# EAGLE board LAUNCHXL2_570LC43_RM57L (EAGLE 7.3.0), part 1 of 4
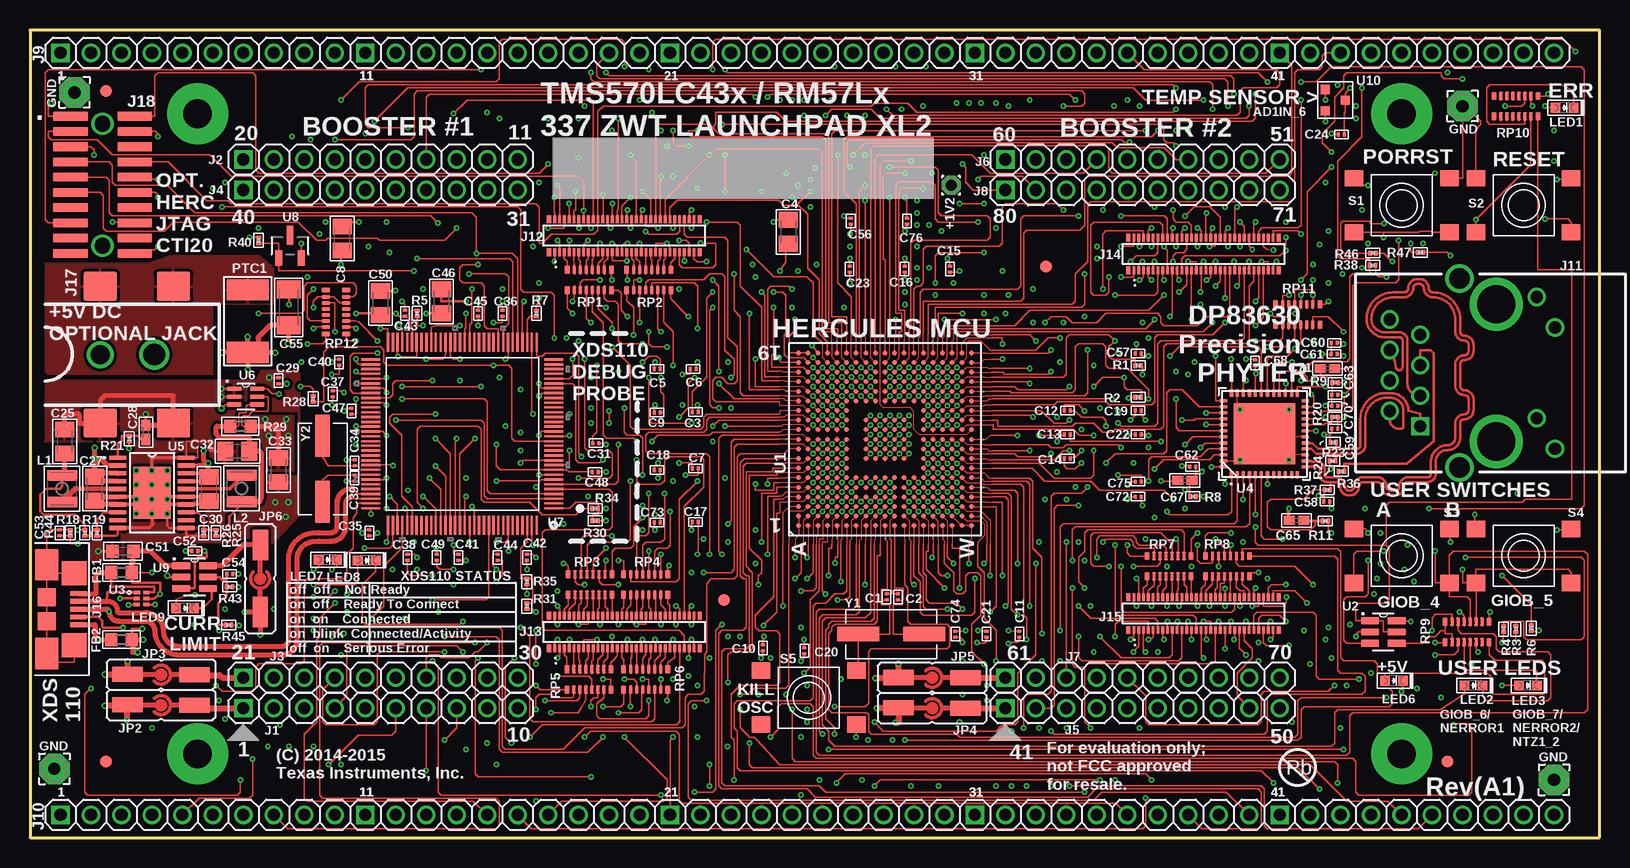
[diagram p17: board, top side]
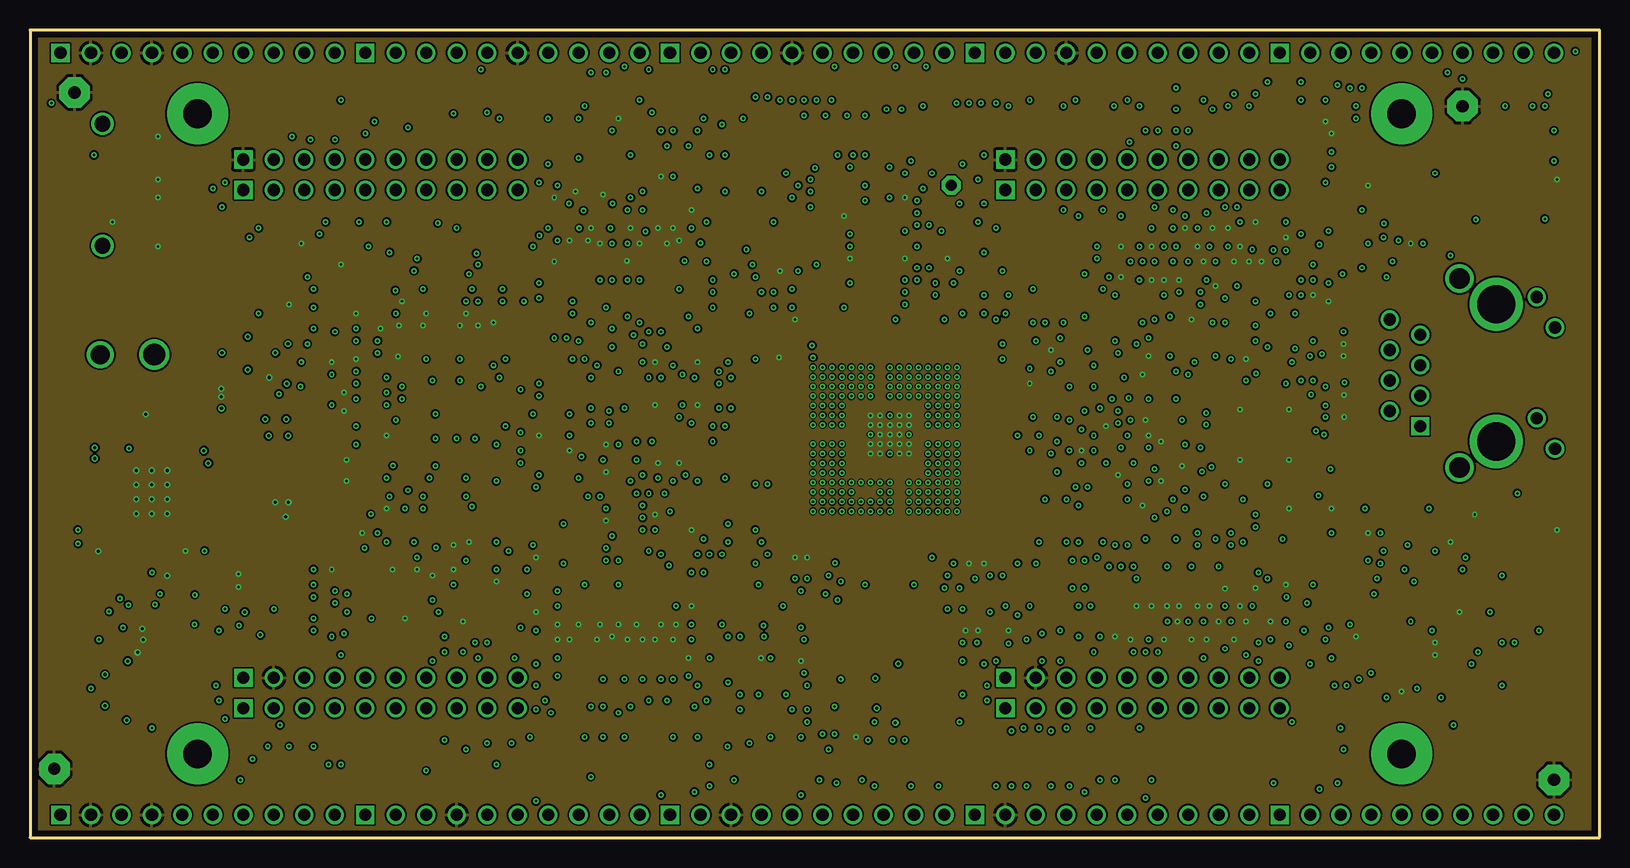
[diagram p18: board, inner layer Route2]
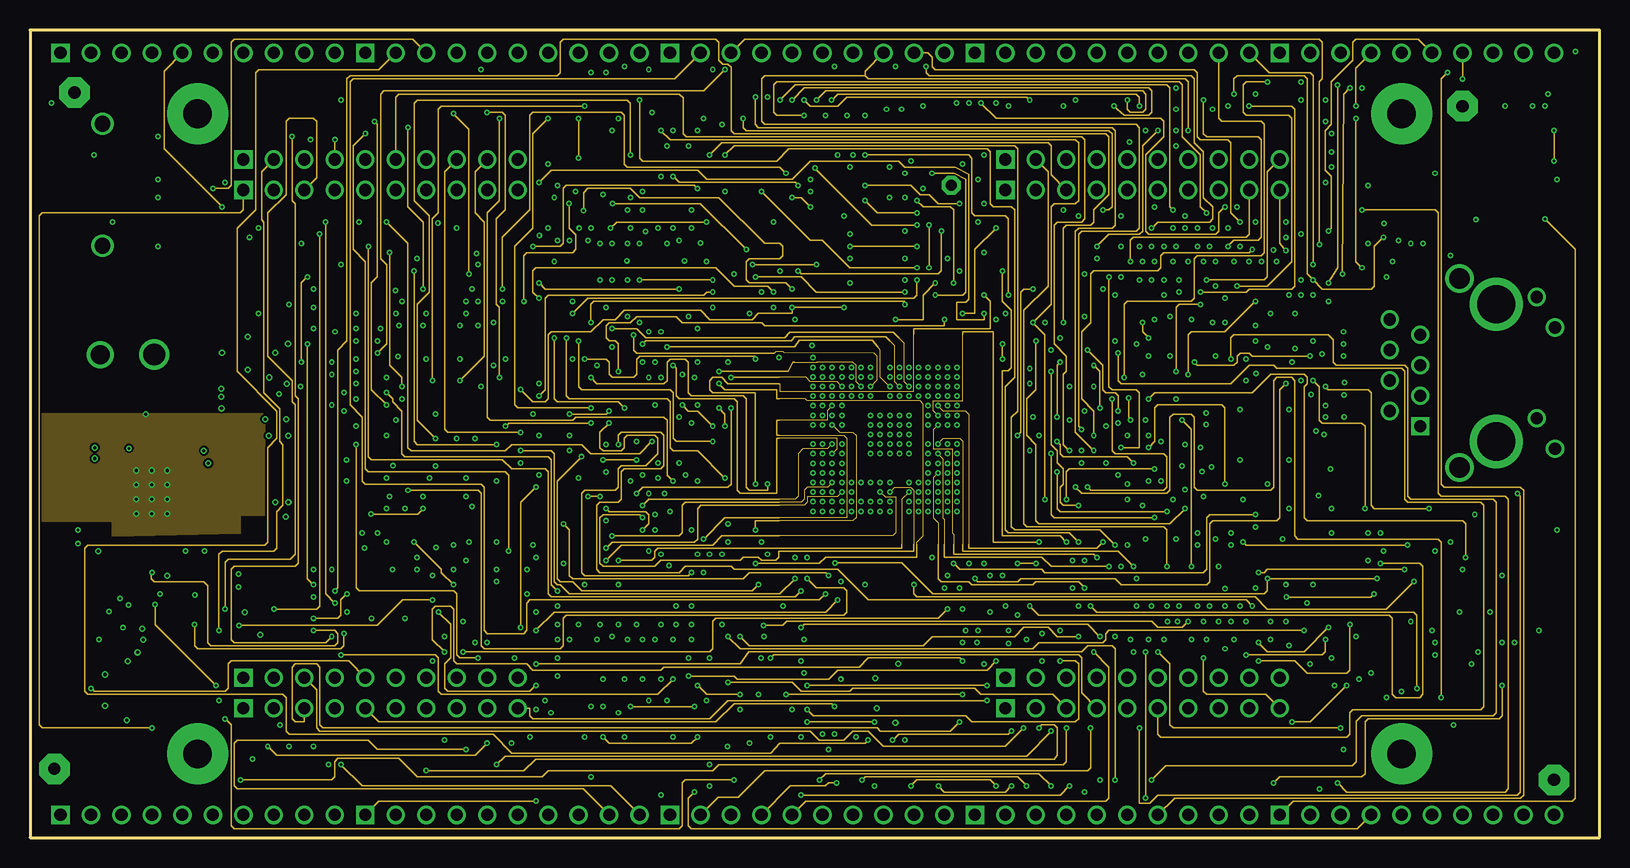
[diagram p19: board, inner layer Route3]
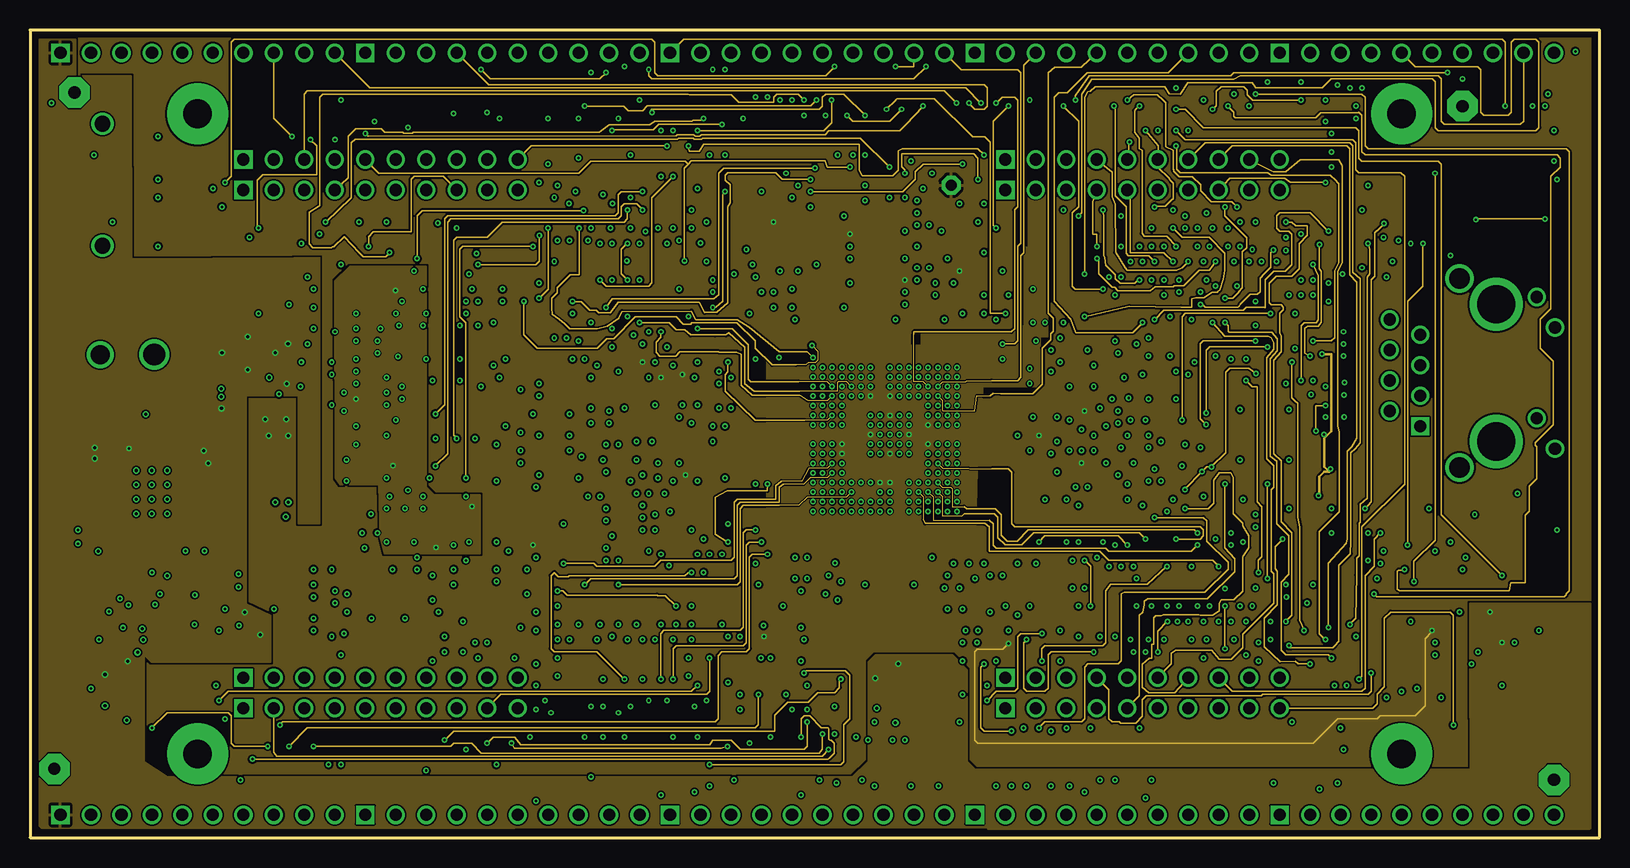
[diagram p20: board, inner layer Route14]
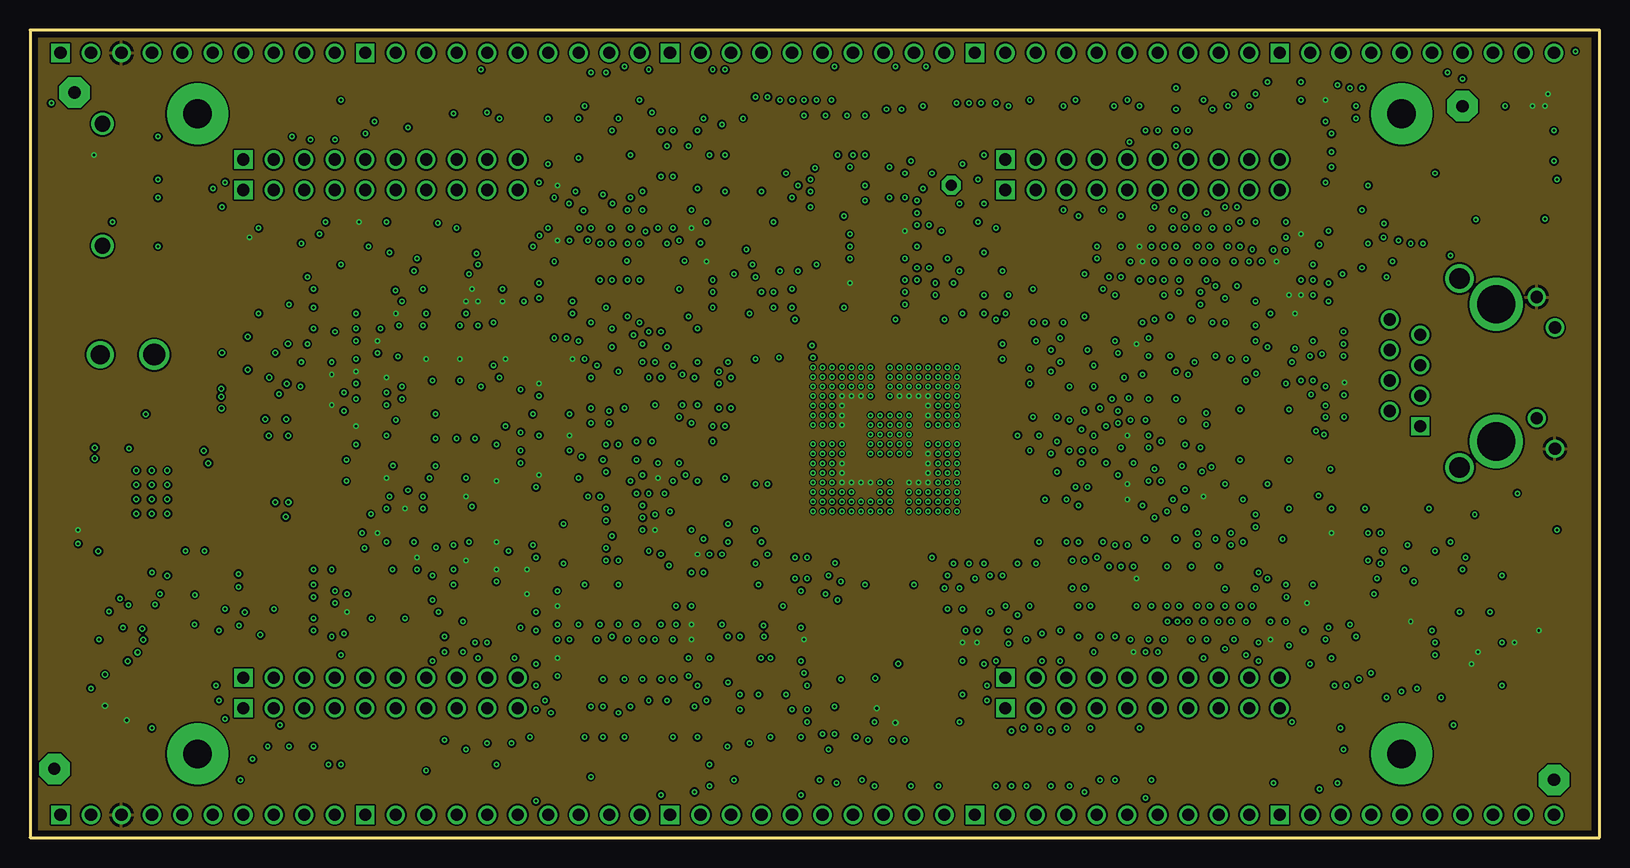
[diagram p21: board, inner layer Route15]
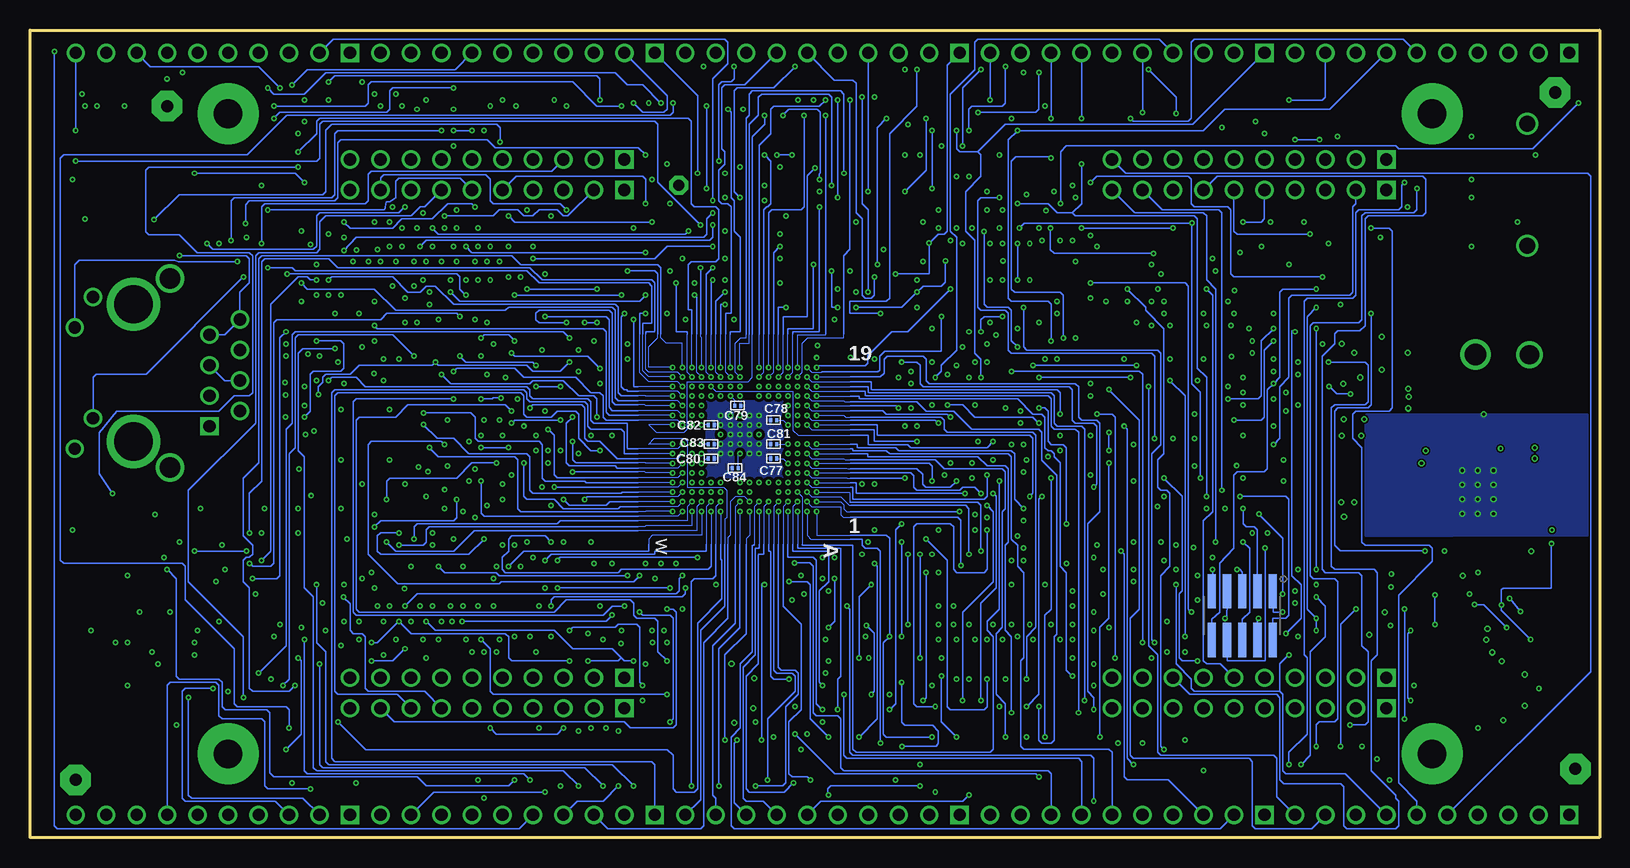
[diagram p22: board, bottom side, seen from below]

Size 130.81 x 67.31 mm. Coordinates in mm from the lower left corner, seen from the top.
Outline: 0,0 130.81,0 130.81,67.31 0,67.31 0,0
Copper layers (1+2*3+14*15+16): Top 0.01714375mm / dielectric 0.24891875mm / Route2 0.01714375mm / dielectric 14mil / Route3 0.01714375mm / dielectric 0.24891875mm / Route14 0.01714375mm / dielectric 14mil / Route15 0.01714375mm / dielectric 0.24891875mm / Bottom 0.01714375mm
Design rules "LAUNCHXL2_570LC43_RM57L_route3 *": minimum track width 4mil, minimum drill 8mil, track to track 4mil, track to pad 4mil, pad to pad 4mil, via to via 4mil, smd to smd 4mil, copper to edge 20mil, drill to drill 15mil, minimum pad ring 10mil, minimum via ring 5mil, stop-mask expansion 3mil, vias tented up to drill 20mil, thermal gap 10mil
Net classes: 0 default: width 0.102 mm, drill 0.203 mm, clearance 0.102 mm; 1 USBD: width 0.406 mm, drill 0.254 mm, clearance 0.102 mm to class 0, clearance 0.102 mm; 2 ETHTD: width 0.203 mm, drill 0.203 mm, clearance 0.102 mm to class 0, clearance 0.102 mm to class 1, clearance 0.102 mm; 3 ETHRD: width 0.203 mm, drill 0.203 mm, clearance 0.102 mm to class 0, clearance 0.102 mm to class 1, clearance 0.102 mm to class 2, clearance 0.102 mm; 4 EMIF: width 0.102 mm, drill 0.203 mm, clearance 0.102 mm to class 0, clearance 0.102 mm to class 1, clearance 0.102 mm to class 2, clearance 0.102 mm to class 3, clearance 0.102 mm; 5 ETM: width 0.102 mm, drill 0.203 mm, clearance 0.102 mm to class 0, clearance 0.102 mm to class 1, clearance 0.102 mm to class 2, clearance 0.102 mm to class 3, clearance 0.102 mm to class 4, clearance 0.102 mm; 6 ETHER: width 0.102 mm, drill 0.203 mm, clearance 0.102 mm to class 0, clearance 0.102 mm to class 1, clearance 0.102 mm to class 2, clearance 0.102 mm to class 3, clearance 0.102 mm to class 4, clearance 0.102 mm to class 5, clearance 0.102 mm; 7 pwr: width 0.102 mm, drill 0.203 mm, clearance 0.102 mm to class 0, clearance 0.102 mm to class 1, clearance 0.102 mm to class 2, clearance 0.102 mm to class 3, clearance 0.102 mm to class 4, clearance 0.102 mm to class 5, clearance 0.102 mm to class 6, clearance 0.102 mm
tKeepout: area 73.7,9.6 to 76.7,14.4; area 9.2,10 to 12.5,14.8; area 18,20 to 20.5,23.2; area 67.2,29.9 to 75.2,37.2
bKeepout: area 67.2,29.9 to 75.2,37.2
tRestrict: area 18,20 to 20.5,23.2; area 9.2,10 to 12.5,14.8; area 73.7,9.6 to 76.7,14.4
vRestrict: area 30,46.7 to 31,47.3; area 71,18.8 to 72.7,25.5; area 24.4,29.6 to 28.4,31.9; area 105.7,28.3 to 120.6,47; area 73.7,9.6 to 76.7,14.4; area 9.2,10 to 12.5,14.8; area 18,20 to 20.5,23.2; area 6,14.9 to 27.3,29.4; area 62.4,24.4 to 80.1,42

## Footprints (pad centres in the part's own frame; a part is rotated, then mirrored left to right if it is on the bottom)
1,6/0,9 = drill 0.914 pad 1.6 octagon: 1 0,0
C0201 = smd 0.25 x 0.35: 1 -0.25,0; 2 0.25,0
C0805K = smd 1.3 x 1.6: 1 -1,0; 2 1,0
C0402K = smd 0.925 x 0.74: 1 -0.6,0; 2 0.6,0
C0603K = smd 1.05 x 1.08: 1 -0.875,0; 2 0.875,0
C1206K = smd 1.5 x 2: 1 -1.5,0; 2 1.5,0
R0603 = smd 1 x 1.1: 1 -0.85,0; 2 0.85,0
FIDUCIAL_1MM = smd 1 x 1: 1 0,0
1X10 = drill 1.016 square: 1 -11.43,0 | drill 1.016: 2 -8.89,0; 3 -6.35,0; 4 -3.81,0; 5 -1.27,0; 6 1.27,0; 7 3.81,0; 8 6.35,0; 9 8.89,0; 10 11.43,0
1X50_ALT = drill 1.016 square: 1 -62.23,0; 11 -36.83,0; 21 -11.43,0; 31 13.97,0; 41 39.37,0 | drill 1.016: 2 -59.69,0; 3 -57.15,0; 4 -54.61,0; 5 -52.07,0; 6 -49.53,0; 7 -46.99,0; 8 -44.45,0; 9 -41.91,0; 10 -39.37,0; 12 -34.29,0; 13 -31.75,0; 14 -29.21,0; 15 -26.67,0; 16 -24.13,0; 17 -21.59,0; 18 -19.05,0; 19 -16.51,0; 20 -13.97,0; 22 -8.89,0; 23 -6.35,0; 24 -3.81,0; 25 -1.27,0; 26 1.27,0; 27 3.81,0; 28 6.35,0; 29 8.89,0; 30 11.43,0; 32 16.51,0; 33 19.05,0; 34 21.59,0; 35 24.13,0; 36 26.67,0; 37 29.21,0; 38 31.75,0; 39 34.29,0; 40 36.83,0; 42 41.91,0; 43 44.45,0; 44 46.99,0; 45 49.53,0; 46 52.07,0; 47 54.61,0; 48 57.15,0; 49 59.69,0; 50 62.23,0
1X50 = drill 1.016 square: 1 -62.23,0; 11 -36.83,0; 21 -11.43,0; 31 13.97,0; 41 39.37,0 | drill 1.016: 2 -59.69,0; 3 -57.15,0; 4 -54.61,0; 5 -52.07,0; 6 -49.53,0; 7 -46.99,0; 8 -44.45,0; 9 -41.91,0; 10 -39.37,0; 12 -34.29,0; 13 -31.75,0; 14 -29.21,0; 15 -26.67,0; 16 -24.13,0; 17 -21.59,0; 18 -19.05,0; 19 -16.51,0; 20 -13.97,0; 22 -8.89,0; 23 -6.35,0; 24 -3.81,0; 25 -1.27,0; 26 1.27,0; 27 3.81,0; 28 6.35,0; 29 8.89,0; 30 11.43,0; 32 16.51,0; 33 19.05,0; 34 21.59,0; 35 24.13,0; 36 26.67,0; 37 29.21,0; 38 31.75,0; 39 34.29,0; 40 36.83,0; 42 41.91,0; 43 44.45,0; 44 46.99,0; 45 49.53,0; 46 52.07,0; 47 54.61,0; 48 57.15,0; 49 59.69,0; 50 62.23,0
DUAL_ABRACRON_ARJC02_111006K_PULSE_J00-0065NL = drill 1.016 square: 1 -4.445,4.285 | drill 1.016: 2 -3.175,6.825; 3 -1.905,4.285; 4 -0.635,6.825; 5 0.635,4.285; 6 1.905,6.825; 7 3.175,4.285; 8 4.445,6.825; 9 -6.32,-6.938; 10 -3.785,-5.418; 11 3.78,-6.938; 12 6.32,-5.418 | drill 1.702: P$1 -7.874,1.008; P$3 7.874,1.008 | drill 3.175: P$2 -5.715,-2.04; P$4 5.715,-2.04
DF40C-60DP-0.4V(51) = smd 0.66 x 0.23: 1 -1.36,5.8; 2 1.36,5.8; 3 -1.36,5.4; 4 1.36,5.4; 5 -1.36,5; 6 1.36,5; 7 -1.36,4.6; 8 1.36,4.6; 9 -1.36,4.2; 10 1.36,4.2; 11 -1.36,3.8; 12 1.36,3.8; 13 -1.36,3.4; 14 1.36,3.4; 15 -1.36,3; 16 1.36,3; 17 -1.36,2.6; 18 1.36,2.6; 19 -1.36,2.2; 20 1.36,2.2; 21 -1.36,1.8; 22 1.36,1.8; 23 -1.36,1.4; 24 1.36,1.4; 25 -1.36,1; 26 1.36,1; 27 -1.36,0.6; 28 1.36,0.6; 29 -1.36,0.2; 30 1.36,0.2; 31 -1.36,-0.2; 32 1.36,-0.2; 33 -1.36,-0.6; 34 1.36,-0.6; 35 -1.36,-1; 36 1.36,-1; 37 -1.36,-1.4; 38 1.36,-1.4; 39 -1.36,-1.8; 40 1.36,-1.8; 41 -1.36,-2.2; 42 1.36,-2.2; 43 -1.36,-2.6; 44 1.36,-2.6; 45 -1.36,-3; 46 1.36,-3; 47 -1.36,-3.4; 48 1.36,-3.4; 49 -1.36,-3.8; 50 1.36,-3.8; 51 -1.36,-4.2; 52 1.36,-4.2; 53 -1.36,-4.6; 54 1.36,-4.6; 55 -1.36,-5; 56 1.36,-5; 57 -1.36,-5.4; 58 1.36,-5.4; 59 -1.36,-5.8; 60 1.36,-5.8 | smd 0.66 x 0.35: 61 -1.36,6.28; 62 1.36,6.28; 63 -1.36,-6.28; 64 1.36,-6.28
USB_MICRO_B_SMD = smd 0.4 x 1.4: 1 -1.3,2.65; 2 -0.65,2.65; 3 0,2.65; 4 0.65,2.65; 5 1.3,2.65 | smd 2 x 2.1: S1 -3,2.3; S2 3,2.3 | smd 2.6 x 1.9: S3 -3.7,0; S4 3.7,0 | smd 1.5 x 1.5: S5 -1,0; S6 1,0
CUI_PJ002BH = smd 2.8 x 2.4: 1A -2.4,5.7; 1B 3.7,5.7; 2 -2.4,-5.7; 3 3.7,-5.7 | drill 1.6: P$3 -2.4,0 | drill 1.8: P$4 2.1,0
SAMTEC-FTR-110-51-S-D-06 = smd 0.711 x 2.87: 1 -5.715,-2.682; 2 -5.715,2.682; 3 -4.445,-2.682; 4 -4.445,2.682; 5 -3.175,-2.682; 6 -3.175,2.682; 7 -1.905,-2.682; 8 -1.905,2.682; 9 -0.635,-2.682; 10 -0.635,2.682; 11 0.635,-2.682; 12 0.635,2.682; 13 1.905,-2.682; 14 1.905,2.682; 15 3.175,-2.682; 16 3.175,2.682; 17 4.445,-2.682; 18 4.445,2.682; 19 5.715,-2.682; 20 5.715,2.682 | drill 1.321: M1 -5.08,0; M2 5.08,0
FTSH-105-01-F-DV = smd 0.737 x 2.794: 1 -2.54,-2.032; 2 -2.54,2.032; 3 -1.27,-2.032; 4 -1.27,2.032; 5 0,-2.032; 6 0,2.032; 7 1.27,-2.032; 8 1.27,2.032; 9 2.54,-2.032; 10 2.54,2.032
JP1_SHORT = smd 1.27 x 2.54: 1 0.025,2.794; 2 0,-2.794
L2520P = smd 0.9 x 2.5: 1 -1.1,0; 2 1.1,0
CHIPLED_0603 = smd 0.8 x 0.8: A 0,-0.75; C 0,0.75
MH_94_200 = drill 2.388 pad 5.08: 1 0,0
2,54/1,1 = drill 1.016 pad 2.54 octagon: 1 0,0
R1812 = smd 1.778 x 3.505: 1 -2.616,0; 2 2.616,0
R0201 = smd 0.28 x 0.43: 1 -0.255,0; 2 0.255,0
RP8_1506_1606 = smd 0.425 x 0.7: 1 -1.84,-0.85; 2 -1.84,0.85; 15 1.84,-0.85; 16 1.84,0.85 | smd 0.3 x 0.7: 3 -1.25,-0.85; 4 -1.25,0.85; 5 -0.75,-0.85; 6 -0.75,0.85; 7 -0.25,-0.85; 8 -0.25,0.85; 9 0.25,-0.85; 10 0.25,0.85; 11 0.75,-0.85; 12 0.75,0.85; 13 1.25,-0.85; 14 1.25,0.85
CK_PTS645_SMD = smd 1.55 x 1.3: 1 -3.975,2.25; 2 3.975,2.25; 3 -3.975,-2.25; 4 3.975,-2.25
ZWT337 = smd 0.4 x 0.4: A1 -7.2,7.2; A2 -6.4,7.2; A3 -5.6,7.2; A4 -4.8,7.2; A5 -4,7.2; A6 -3.2,7.2; A7 -2.4,7.2; A8 -1.6,7.2; A9 -0.8,7.2; A10 0,7.2; A11 0.8,7.2; A12 1.6,7.2; A13 2.4,7.2; A14 3.2,7.2; A15 4,7.2; A16 4.8,7.2; A17 5.6,7.2; A18 6.4,7.2; A19 7.2,7.2; B1 -7.2,6.4; B2 -6.4,6.4; B3 -5.6,6.4; B4 -4.8,6.4; B5 -4,6.4; B6 -3.2,6.4; B7 -2.4,6.4; B8 -1.6,6.4; B9 -0.8,6.4; B10 0,6.4; B11 0.8,6.4; B12 1.6,6.4; B13 2.4,6.4; B14 3.2,6.4; B15 4,6.4; B16 4.8,6.4; B17 5.6,6.4; B18 6.4,6.4; B19 7.2,6.4; C1 -7.2,5.6; C2 -6.4,5.6; C3 -5.6,5.6; C4 -4.8,5.6; C5 -4,5.6; C6 -3.2,5.6; C7 -2.4,5.6; C8 -1.6,5.6; C9 -0.8,5.6; C10 0,5.6; C11 0.8,5.6; C12 1.6,5.6; C13 2.4,5.6; C14 3.2,5.6; C15 4,5.6; C16 4.8,5.6; C17 5.6,5.6; C18 6.4,5.6; C19 7.2,5.6; D1 -7.2,4.8; D2 -6.4,4.8; D3 -5.6,4.8; D4 -4.8,4.8; D5 -4,4.8; D6 -3.2,4.8; D7 -2.4,4.8; D8 -1.6,4.8; D9 -0.8,4.8; D10 0,4.8; D11 0.8,4.8; D12 1.6,4.8; D13 2.4,4.8; D14 3.2,4.8; D15 4,4.8; D16 4.8,4.8; D17 5.6,4.8; D18 6.4,4.8; D19 7.2,4.8; E1 -7.2,4; E2 -6.4,4; E3 -5.6,4; E4 -4.8,4; E5 -4,4; E6 -3.2,4; E7 -2.4,4; E8 -1.6,4; E9 -0.8,4; E10 0,4; E11 0.8,4; E12 1.6,4; E13 2.4,4; E14 3.2,4; E15 4,4; E16 4.8,4; E17 5.6,4; E18 6.4,4; E19 7.2,4; F1 -7.2,3.2; F2 -6.4,3.2; F3 -5.6,3.2; F4 -4.8,3.2; F5 -4,3.2; F6 -3.2,3.2; F7 -2.4,3.2; F8 -1.6,3.2; F9 -0.8,3.2; F10 0,3.2; F11 0.8,3.2; F12 1.6,3.2; F13 2.4,3.2; F14 3.2,3.2; F15 4,3.2; F16 4.8,3.2; F17 5.6,3.2; F18 6.4,3.2; F19 7.2,3.2; G1 -7.2,2.4; G2 -6.4,2.4; G3 -5.6,2.4; G4 -4.8,2.4; G5 -4,2.4; G6 -3.2,2.4; G14 3.2,2.4; G15 4,2.4; G16 4.8,2.4; G17 5.6,2.4; G18 6.4,2.4; G19 7.2,2.4; H1 -7.2,1.6; H2 -6.4,1.6; H3 -5.6,1.6; H4 -4.8,1.6; H5 -4,1.6; H6 -3.2,1.6; H8 -1.6,1.6; H9 -0.8,1.6; H10 0,1.6; H11 0.8,1.6; H12 1.6,1.6; H14 3.2,1.6; H15 4,1.6; H16 4.8,1.6; H17 5.6,1.6; H18 6.4,1.6; H19 7.2,1.6; J1 -7.2,0.8; J2 -6.4,0.8; J3 -5.6,0.8; J4 -4.8,0.8; J5 -4,0.8; J6 -3.2,0.8; J8 -1.6,0.8; J9 -0.8,0.8; J10 0,0.8; J11 0.8,0.8; J12 1.601,0.8; J14 3.2,0.8; J15 4,0.8; J16 4.8,0.8; J17 5.6,0.8; J18 6.4,0.8; J19 7.2,0.8; K1 -7.2,0; K2 -6.4,0; K3 -5.6,0; K4 -4.8,0; K5 -4,0; K6 -3.2,0; K8 -1.6,0; K9 -0.8,0; K10 0,0; K11 0.8,0; K12 1.6,0; K14 3.2,0; K15 4,0; K16 4.8,0; K17 5.6,0; K18 6.4,0; K19 7.2,0; L1 -7.2,-0.8; L2 -6.4,-0.8; L3 -5.6,-0.8; L4 -4.8,-0.8; L5 -4,-0.8; L6 -3.2,-0.8; L8 -1.6,-0.8; L9 -0.8,-0.8; L10 0,-0.8; L11 0.8,-0.8; L12 1.6,-0.8; L14 3.2,-0.8; L15 4,-0.8; L16 4.8,-0.8; L17 5.6,-0.8; L18 6.4,-0.8; L19 7.2,-0.8; M1 -7.2,-1.6; M2 -6.4,-1.6; M3 -5.6,-1.6; M4 -4.8,-1.6; M5 -4,-1.6; M6 -3.2,-1.6; M8 -1.6,-1.6; M9 -0.8,-1.6; M10 0,-1.6; M11 0.8,-1.6; M12 1.6,-1.6; M14 3.2,-1.6; M15 4,-1.6; M16 4.8,-1.6; M17 5.6,-1.6; M18 6.4,-1.6; M19 7.2,-1.6; N1 -7.2,-2.4; N2 -6.4,-2.4; N3 -5.6,-2.4; N4 -4.8,-2.4; N5 -4,-2.4; N6 -3.2,-2.4; N14 3.2,-2.4; N15 4,-2.4; N16 4.8,-2.4; N17 5.6,-2.4; N18 6.4,-2.4; N19 7.2,-2.4; P1 -7.2,-3.2; P2 -6.4,-3.2; P3 -5.6,-3.2; P4 -4.8,-3.2; P5 -4,-3.2; P6 -3.2,-3.2; P7 -2.4,-3.2; P8 -1.6,-3.2; P9 -0.8,-3.2; P10 0,-3.2; P11 0.8,-3.2; P12 1.6,-3.2; P13 2.4,-3.2; P14 3.2,-3.2; P15 4,-3.2; P16 4.8,-3.2; P17 5.6,-3.2; P18 6.4,-3.2; P19 7.2,-3.2; R1 -7.2,-4; R2 -6.4,-4; R3 -5.6,-4; R4 -4.8,-4; R5 -4,-4; R6 -3.2,-4; R7 -2.4,-4; R8 -1.6,-4; R9 -0.8,-4; R10 0,-4; R11 0.8,-4; R12 1.6,-4; R13 2.4,-4; R14 3.2,-4; R15 4,-4; R16 4.8,-4; R17 5.6,-4; R18 6.4,-4; R19 7.2,-4; T1 -7.2,-4.8; T2 -6.4,-4.8; T3 -5.6,-4.8; T4 -4.8,-4.8; T5 -4,-4.8; T6 -3.2,-4.8; T7 -2.4,-4.8; T8 -1.6,-4.8; T9 -0.8,-4.8; T10 0,-4.8; T11 0.8,-4.8; T12 1.6,-4.8; T13 2.4,-4.8; T14 3.2,-4.8; T15 4,-4.8; T16 4.8,-4.8; T17 5.6,-4.8; T18 6.4,-4.8; T19 7.2,-4.8; U1 -7.2,-5.6; U2 -6.4,-5.6; U3 -5.6,-5.6; U4 -4.8,-5.6; U5 -4,-5.6; U6 -3.2,-5.6; U7 -2.4,-5.6; U8 -1.6,-5.6; U9 -0.8,-5.6; U10 0,-5.6; U11 0.8,-5.6; U12 1.6,-5.6; U13 2.4,-5.6; U14 3.2,-5.6; U15 4,-5.6; U16 4.8,-5.6; U17 5.6,-5.6; U18 6.4,-5.6; U19 7.2,-5.6; V1 -7.2,-6.4; V2 -6.4,-6.4; V3 -5.6,-6.4; V4 -4.8,-6.4; V5 -4,-6.4; V6 -3.2,-6.4; V7 -2.4,-6.4; V8 -1.6,-6.4; V9 -0.8,-6.4; V10 0,-6.4; V11 0.8,-6.4; V12 1.6,-6.4; V13 2.4,-6.4; V14 3.2,-6.4; V15 4,-6.4; V16 4.8,-6.4; V17 5.6,-6.4; V18 6.4,-6.4; V19 7.2,-6.4; W1 -7.2,-7.2; W2 -6.4,-7.2; W3 -5.6,-7.2; W4 -4.8,-7.2; W5 -4,-7.2; W6 -3.2,-7.2; W7 -2.4,-7.2; W8 -1.6,-7.2; W9 -0.8,-7.2; W10 0,-7.2; W11 0.8,-7.2; W12 1.6,-7.2; W13 2.4,-7.2; W14 3.2,-7.2; W15 4,-7.2; W16 4.8,-7.2; W17 5.6,-7.2; W18 6.4,-7.2; W19 7.2,-7.2
DBV6 = smd 1.473 x 0.559: 1 -1.118,0.94; 2 -1.118,0; 3 -1.118,-0.94; 4 1.118,-0.94; 5 1.118,0; 6 1.118,0.94
DRY6 = smd 0.552 x 0.292: 1 -0.359,0.514 | smd 0.502 x 0.292: 2 -0.384,0; 3 -0.384,-0.514; 4 0.384,-0.514; 5 0.384,0; 6 0.384,0.514
SQA48A = smd 0.61 x 0.254: 1 -3.404,2.743; 2 -3.404,2.261; 3 -3.404,1.753; 4 -3.404,1.245; 5 -3.404,0.762; 6 -3.404,0.254; 7 -3.404,-0.254; 8 -3.404,-0.762; 9 -3.404,-1.245; 10 -3.404,-1.753; 11 -3.404,-2.261; 12 -3.404,-2.743; 25 3.404,-2.743; 26 3.404,-2.261; 27 3.404,-1.753; 28 3.404,-1.245; 29 3.404,-0.762; 30 3.404,-0.254; 31 3.404,0.254; 32 3.404,0.762; 33 3.404,1.245; 34 3.404,1.753; 35 3.404,2.261; 36 3.404,2.743 | smd 0.254 x 0.61: 13 -2.743,-3.404; 14 -2.261,-3.404; 15 -1.753,-3.404; 16 -1.245,-3.404; 17 -0.762,-3.404; 18 -0.254,-3.404; 19 0.254,-3.404; 20 0.762,-3.404; 21 1.245,-3.404; 22 1.753,-3.404; 23 2.261,-3.404; 24 2.743,-3.404; 37 2.743,3.404; 38 2.261,3.404; 39 1.753,3.404; 40 1.245,3.404; 41 0.762,3.404; 42 0.254,3.404; 43 -0.254,3.404; 44 -0.762,3.404; 45 -1.245,3.404; 46 -1.753,3.404; 47 -2.261,3.404; 48 -2.743,3.404 | smd 5.105 x 5.105: 49 0,0
MXA20A = smd 1.422 x 0.356: 1 -2.845,2.921; 2 -2.845,2.286; 3 -2.845,1.626; 4 -2.845,0.965; 5 -2.845,0.33; 6 -2.845,-0.33; 7 -2.845,-0.965; 8 -2.845,-1.626; 9 -2.845,-2.286; 10 -2.845,-2.921; 11 2.845,-2.921; 12 2.845,-2.286; 13 2.845,-1.626; 14 2.845,-0.965; 15 2.845,-0.33; 16 2.845,0.33; 17 2.845,0.965; 18 2.845,1.626; 19 2.845,2.286; 20 2.845,2.921 | smd 3.15 x 4.343: 21 0,0
DCK6 = smd 1.168 x 0.356: 1 -0.965,0.66; 2 -0.965,0; 3 -0.965,-0.66; 4 0.965,-0.66; 5 0.965,0; 6 0.965,0.66
PDT128 = smd 1.575 x 0.191: 1 -7.62,6.198; 2 -7.62,5.791; 3 -7.62,5.41; 4 -7.62,5.004; 5 -7.62,4.597; 6 -7.62,4.191; 7 -7.62,3.81; 8 -7.62,3.404; 9 -7.62,2.997; 10 -7.62,2.591; 11 -7.62,2.21; 12 -7.62,1.803; 13 -7.62,1.397; 14 -7.62,0.991; 15 -7.62,0.61; 16 -7.62,0.203; 17 -7.62,-0.203; 18 -7.62,-0.61; 19 -7.62,-0.991; 20 -7.62,-1.397; 21 -7.62,-1.803; 22 -7.62,-2.21; 23 -7.62,-2.591; 24 -7.62,-2.997; 25 -7.62,-3.404; 26 -7.62,-3.81; 27 -7.62,-4.191; 28 -7.62,-4.597; 29 -7.62,-5.004; 30 -7.62,-5.41; 31 -7.62,-5.791; 32 -7.62,-6.198; 65 7.62,-6.198; 66 7.62,-5.791; 67 7.62,-5.41; 68 7.62,-5.004; 69 7.62,-4.597; 70 7.62,-4.191; 71 7.62,-3.81; 72 7.62,-3.404; 73 7.62,-2.997; 74 7.62,-2.591; 75 7.62,-2.21; 76 7.62,-1.803; 77 7.62,-1.397; 78 7.62,-0.991; 79 7.62,-0.61; 80 7.62,-0.203; 81 7.62,0.203; 82 7.62,0.61; 83 7.62,0.991; 84 7.62,1.397; 85 7.62,1.803; 86 7.62,2.21; 87 7.62,2.591; 88 7.62,2.997; 89 7.62,3.404; 90 7.62,3.81; 91 7.62,4.191; 92 7.62,4.597; 93 7.62,5.004; 94 7.62,5.41; 95 7.62,5.791; 96 7.62,6.198 | smd 0.191 x 1.575: 33 -6.198,-7.62; 34 -5.791,-7.62; 35 -5.41,-7.62; 36 -5.004,-7.62; 37 -4.597,-7.62; 38 -4.191,-7.62; 39 -3.81,-7.62; 40 -3.404,-7.62; 41 -2.997,-7.62; 42 -2.591,-7.62; 43 -2.21,-7.62; 44 -1.803,-7.62; 45 -1.397,-7.62; 46 -0.991,-7.62; 47 -0.61,-7.62; 48 -0.203,-7.62; 49 0.203,-7.62; 50 0.61,-7.62; 51 0.991,-7.62; 52 1.397,-7.62; 53 1.803,-7.62; 54 2.21,-7.62; 55 2.591,-7.62; 56 2.997,-7.62; 57 3.404,-7.62; 58 3.81,-7.62; 59 4.191,-7.62; 60 4.597,-7.62; 61 5.004,-7.62; 62 5.41,-7.62; 63 5.791,-7.62; 64 6.198,-7.62; 97 6.198,7.62; 98 5.791,7.62; 99 5.41,7.62; 100 5.004,7.62; 101 4.597,7.62; 102 4.191,7.62; 103 3.81,7.62; 104 3.404,7.62; 105 2.997,7.62; 106 2.591,7.62; 107 2.21,7.62; 108 1.803,7.62; 109 1.397,7.62; 110 0.991,7.62; 111 0.61,7.62; 112 0.203,7.62; 113 -0.203,7.62; 114 -0.61,7.62; 115 -0.991,7.62; 116 -1.397,7.62; 117 -1.803,7.62; 118 -2.21,7.62; 119 -2.591,7.62; 120 -2.997,7.62; 121 -3.404,7.62; 122 -3.81,7.62; 123 -4.191,7.62; 124 -4.597,7.62; 125 -5.004,7.62; 126 -5.41,7.62; 127 -5.791,7.62; 128 -6.198,7.62
DBZ3 = smd 0.559 x 1.321: 1 -0.94,-1.016; 2 0.94,-1.016 | smd 0.559 x 1.575: 3 0,0.889
SOT23 = smd 0.762 x 0.762: 1 -0.889,-0.762; 2 0.889,-0.762; 3 0,0.889
CSM-3X = smd 3.5 x 1.2: 1 -2.75,0; 2 2.75,0

## Placement (x,y rotation side)
+1V2  DNP  [1,6/0,9]  76.76,54.38 270 top
C1  33pF  [C0201]  71.39,20.07 90 top
C2  33pF  [C0201]  72.32,20.07 90 top
C3  1000pF  [C0201]  55.45,35.48 0 top
C4  10uF  [C0805K]  63.2,50.5 270 top
C5  0.1uF  [C0201]  52.25,39.05 180 top
C6  0.01uF  [C0201]  55.25,39.06 0 top
C7  1000pF  [C0201]  55.45,30.76 180 top
C8  10uF  [C0805K]  26.01,49.94 270 top
C9  0.1uF  [C0201]  52.25,35.44 180 top
C10  0.01uF  [C0201]  61.07,15.82 270 top
C11  1000pF  [C0201]  82.44,16.97 90 top
C12  0.1uF  [C0201]  86.45,35.6 0 top
C13  0.01uF  [C0201]  86.45,33.6 0 top
C14  1000pF  [C0201]  86.45,31.6 0 top
C15  0.1uF  [C0201]  76.66,47.38 90 top
C16  0.01uF  [C0201]  72.88,47.38 90 top
C17  0.1uF  [C0201]  55.45,26.32 180 top
C18  1000pF  [C0201]  52.25,30.65 180 top
C19  0.1uF  [C0201]  92.35,35.6 0 top
C20  0.01uF  [C0201]  64.53,15.58 270 top
C21  0.1uF  [C0201]  79.72,16.97 90 top
C22  1000pF  [C0201]  92.35,33.6 0 top
C23  0.01uF  [C0201]  68.31,47.38 90 top
C24  4700pF  [C0201]  109.28,58.61 180 top
C25  22uF  [C0805K]  2.9,33.02 90 top
C27  22uF  [C0805K]  5.39,29.08 270 top
C28  1uF  [C0402K]  9.65,33.78 90 top
C29  0.1uF  [C0201]  20.7,38.1 90 top
C30  22uF  [C0805K]  14.91,29.06 270 top
C31  4700pF  [C0201]  47.16,32.88 0 top
C32  22uF  [C0805K]  17.27,32.21 180 top
C33  22uF  [C0805K]  20.7,30.63 270 top
C34  33pF  [C0201]  27.05,31.24 90 top
C35  0.01uF  [C0201]  28.28,25.42 90 top
C36  1000pF  [C0201]  39.37,43.69 270 top
C37  1000pF  [C0201]  25.23,36.98 90 top
C38  0.1uF  [C0201]  31.46,23.37 270 top
C39  33pF  [C0201]  27.05,29.97 270 top
C40  0.01uF  [C0201]  25.76,39.62 90 top
C41  1000pF  [C0201]  35.71,23.37 90 top
C42  0.01uF  [C0201]  41.4,23.37 90 top
C43  0.1uF  [C0201]  31.24,43.69 90 top
C44  1000pF  [C0201]  38.97,23.37 270 top
C45  0.1uF  [C0201]  37.34,43.69 270 top
C46  10uF  [C0805K]  34.29,44.7 270 top
C47  0.1uF  [C0201]  26.78,35.56 90 top
C48  0.1uF  [C0201]  47.1,30.48 0 top
C49  0.01uF  [C0201]  33.89,23.37 270 top
C50  10uF  [C0805K]  29.21,44.55 270 top
C51  4.7uF  [C0603K]  7.75,23.88 180 top
C52  0.1uF  [C0201]  13.74,23.89 180 top
C53  4700pF  [C0201]  2.45,25.4 90 top
C54  4700pF  [C0201]  16.64,21.97 0 top
C55  100uF  [C1206K]  21.56,44.2 90 top
C56  1000pF  [C0201]  68.4,51.38 90 top
C57  0.01uF  [C0201]  92.35,40.34 0 top
C58  0.1uF  [C0201]  108.08,28.02 0 top
C59  0.1uF  [C0201]  108.74,34.09 0 top
C60  0.1uF  [C0201]  108.69,41.24 0 top
C61  0.1uF  [C0201]  108.67,40.31 0 top
C62  0.01uF  [C0201]  96.88,30.91 180 top
C63  0.1uF  [C0201]  108.74,36.91 0 top
C65  1uF  [C0402K]  105.54,26.44 180 top
C67  1uF  [C0402K]  96.23,29.77 180 top
C68  0.1uF  [C0201]  102.09,39.58 90 top
C70  0.01uF  [C0201]  108.74,35.99 0 top
C71  1uF  [C0402K]  108.13,39.1 0 top
C72  0.01uF  [C0201]  92.35,28.43 0 top
C73  0.1uF  [C0201]  52.25,26.27 0 top
C74  1000pF  [C0201]  77.11,16.97 90 top
C75  0.1uF  [C0201]  92.35,29.67 0 top
C76  0.1uF  [C0201]  73.08,51.38 90 top
C77  1000pF  [C0201]  68.85,31.6 180 bottom
C78  1000pF  [C0201]  68.85,34.8 180 bottom
C79  1000pF  [C0201]  71.85,36 0 bottom
C80  1000pF  [C0201]  74.05,31.6 0 bottom
C81  1000pF  [C0201]  68.85,32.8 180 bottom
C82  1000pF  [C0201]  74.05,34.4 0 bottom
C83  1000pF  [C0201]  74.05,32.8 0 bottom
C84  0.1uF  [C0201]  72.05,30.8 180 bottom
DRILEGEND  [DRILEGEND]  -36.88,-7.7 0 top  (outside the outline)
FB1  30 OHM @ 100MHz  [R0603]  7.62,22.1 0 top
FB2  30 OHM @ 100MHz  [R0603]  7.62,16.51 0 top
FID1  DNP  [FIDUCIAL_1MM]  6.35,6.35 0 top
FID2  DNP  [FIDUCIAL_1MM]  6.35,62.23 0 top
FID3  DNP  [FIDUCIAL_1MM]  118.11,6.35 0 top
FID4  DNP  [FIDUCIAL_1MM]  84.65,47.6 180 top
FID5  DNP  [FIDUCIAL_1MM]  57.85,19.8 180 top
J1  [1X10]  29.21,10.79 0 top
J2  [1X10]  29.21,56.52 0 top
J3  [1X10]  29.21,13.34 0 top
J4  [1X10]  29.21,53.98 0 top
J5  [1X10]  92.71,10.79 0 top
J6  [1X10]  92.71,56.52 0 top
J7  [1X10]  92.71,13.34 0 top
J8  [1X10]  92.71,53.98 0 top
J9  [1X50_ALT]  64.77,65.41 0 top
J10  [1X50]  64.77,1.91 0 top
J11  MAGJACKARJCO2-111006E  [DUAL_ABRACRON_ARJC02_111006K_PULSE_J00-0065NL]  120.14,38.73 90 top
J12  DF40C-60DP-0.4V(51)  [DF40C-60DP-0.4V(51)]  49.53,50.16 90 top
J13  DF40C-60DP-0.4V(51)  [DF40C-60DP-0.4V(51)]  49.53,17.14 90 top
J14  DF40C-60DP-0.4V(51)  [DF40C-60DP-0.4V(51)]  97.79,48.64 90 top
J15  DF40C-60DP-0.4V(51)  [DF40C-60DP-0.4V(51)]  97.79,18.67 90 top
J16  USB_MICRO_B_SMD  [USB_MICRO_B_SMD]  1.4,19.05 270 top
J17  [CUI_PJ002BH]  8.26,40.26 0 top
J18  [SAMTEC-FTR-110-51-S-D-06]  6.05,54.41 270 top
J19  [FTSH-105-01-F-DV]  29.79,18.51 180 bottom
JP2  SHORT  [JP1_SHORT]  10.92,11.05 90 top
JP3  SHORT  [JP1_SHORT]  10.92,13.59 90 top
JP4  SHORT  [JP1_SHORT]  75.18,10.79 90 top
JP5  SHORT  [JP1_SHORT]  75.18,13.34 90 top
JP6  SHORT  [JP1_SHORT]  19.18,21.59 0 top
L1  1uH  [L2520P]  2.67,29.08 270 top
L2  1uH  [L2520P]  17.63,29.11 270 top
LED1  RED  [CHIPLED_0603]  127.89,60.83 270 top
LED2  GRN  [CHIPLED_0603]  120.3,12.7 270 top
LED3  GRN  [CHIPLED_0603]  124.83,12.7 270 top
LED6  GRN  [CHIPLED_0603]  113.67,13.08 270 top
LED7  GRN  [CHIPLED_0603]  24.81,23.17 270 top
LED8  GRN  [CHIPLED_0603]  28.06,23.12 270 top
LED9  RED  [CHIPLED_0603]  12.93,19.13 270 top
MH1  DNP  [MH_94_200]  13.97,6.99 0 top
MH2  DNP  [MH_94_200]  114.3,60.33 0 top
MH3  DNP  [MH_94_200]  114.3,6.99 0 top
MH4  DNP  [MH_94_200]  13.97,60.33 0 top
PAD9  DNP  [2,54/1,1]  119.38,60.96 180 top
PAD10  DNP  [2,54/1,1]  3.71,62.1 90 top
PAD11  DNP  [2,54/1,1]  127,4.83 0 top
PAD12  DNP  [2,54/1,1]  2.03,5.74 0 top
PTC1  3A IH / 5A IT  [R1812]  18.16,43.05 90 top
R1  0  [R0201]  92.35,39.34 180 top
R2  0  [R0201]  92.35,36.71 180 top
R3  0  [R0201]  123.82,17.38 90 top
R4  0  [R0201]  122.8,17.38 90 top
R5  4.87K  [R0201]  32.26,43.69 90 top
R6  8.45K  [R0201]  125.11,17.48 90 top
R7  49.9  [R0201]  42.2,43.7 90 top
R8  0  [R0201]  96.91,28.44 180 top
R9  0  [R0201]  108.76,37.92 180 top
R11  0  [R0201]  107.95,26.39 180 top
R18  27K  [R0201]  4.57,25.4 90 top
R19  8.45K  [R0201]  5.59,25.4 270 top
R20  4.87K  [R0201]  108.74,35.05 180 top
R21  5.1  [R0201]  8.28,33.25 90 top
R23  49.9  [R0201]  108.6,32.95 0 top
R24  49.9  [R0201]  108.55,31.41 0 top
R25  4.87K  [R0201]  15.49,25.4 90 top
R26  8.45K  [R0201]  14.48,25.4 90 top
R28  27K  [R0201]  23.6,36.58 90 top
R29  0.010  [R0603]  17.53,34.29 180 top
R30  330K  [R0201]  47.1,26.42 180 top
R31  330K  [R0201]  41.4,19.3 90 top
R34  220K  [R0201]  47.1,27.43 180 top
R35  220K  [R0201]  41.4,21.34 270 top
R36  49.9  [R0201]  109.27,30.53 180 top
R37  49.9  [R0201]  108.1,28.99 0 top
R38  49.9  [R0201]  111.89,47.7 180 top
R40  49.9  [R0201]  19.05,49.78 270 top
R43  220K  [R0201]  16.64,20.9 0 top
R44  1M  [R0201]  3.35,25.4 270 top
R45  61.9K  [R0201]  16.56,17.73 180 top
R46  49.9  [R0201]  111.91,48.72 180 top
R47  0  [R0201]  115.87,48.78 180 top
RP1  56  [RP8_1506_1606]  46.61,46.48 0 top
RP2  56  [RP8_1506_1606]  51.56,46.48 0 top
RP3  56  [RP8_1506_1606]  46.67,21.1 180 top
RP4  56  [RP8_1506_1606]  51.31,21.1 180 top
RP5  56  [RP8_1506_1606]  46.57,13.19 0 top
RP6  56  [RP8_1506_1606]  51.31,13.19 0 top
RP7  56  [RP8_1506_1606]  94.92,22.62 180 top
RP8  56  [RP8_1506_1606]  99.78,22.62 180 top
RP9  2.2K  [RP8_1506_1606]  119.76,17.14 0 top
RP10  2.2K  [RP8_1506_1606]  123.83,60.96 180 top
RP11  2.2K  [RP8_1506_1606]  105.65,43.6 180 top
RP12  2.2K  [RP8_1506_1606]  25.51,43.81 90 top
S1  TACT6MM_NO_MOM  [CK_PTS645_SMD]  114.3,52.7 0 top
S2  TACT6MM_NO_MOM  [CK_PTS645_SMD]  124.46,52.7 0 top
S3  TACT6MM_NO_MOM  [CK_PTS645_SMD]  114.3,23.5 0 top
S4  TACT6MM_NO_MOM  [CK_PTS645_SMD]  124.46,23.5 0 top
S5  TACT6MM_NO_MOMHALF_CK  [CK_PTS645_SMD]  64.91,11.67 180 top
U1  RM57L843_TMS570LC4357_ZWT_337  [ZWT337]  71.25,33.2 90 top
U2  TPS3106K33_DBV_6  [DBV6]  112.78,17.14 0 top
U3  TPD4E004_DRY_6  [DRY6]  9.29,19.93 0 top
U4  DP83630_RHS_48  [SQA48A]  102.87,33.66 90 top
U5  LM26420XMHX/NOPB  [MXA20A]  10.17,28.74 0 top
U6  INA210_DCK_6  [DCK6]  17.99,36.75 0 top
U7  TM4C129ENCPDT  [PDT128]  36.03,33.66 180 top
U8  LM4040D30_DBZ_3  [DBZ3]  21.67,49.33 0 top
U9  TPS2553_DBV_6  [DBV6]  13.72,21.72 0 top
U10  1K  [SOT23]  108.71,61.47 270 top
Y1  16.00MHZ  [CSM-3X]  71.78,16.96 180 top
Y2  16.00MHZ  [CSM-3X]  24.38,30.73 90 top

## Tracks (layer width: path | path; a pad name or v marks a point on that pad's centre or on a via)
5V_USB_LIMITED
  Top 0.406: JP6.1 19.19,24.4 17.75,24.4 16.01,22.66 U9.6
+1V2  (via drill 0.2, 0.2 pad 0.25, 0.2 pad 0.46, 0.25)
  Top 0.102: U1.F10 v67.65,32.8 | U1.F9 v67.65,32 | U1.J14 v70.05,36.8 | U1.P11 v74.85,34.4 | U1.K8 v71.65,32 | U1.H10 v70.05,33.6 | U1.M10 v73.25,33.6 | U1.K12 v71.65,35.2 | U1.K6 v70.85,29.6 | U1.L6 v71.65,29.6 | U1.P10 v74.85,32.8
  Top 0.127: U6.5 19.79,36.75 19.86,36.68 19.86,35.64 19.77,35.53 18.5,35.53 18.24,35.15 17.83,35.15 17.65,35 17.65,34.39 17.78,34.29 R29.1 | U1.K14 v71.65,36.8 | C5.1 52.5,39.88 52.25,40.13 51.56,40.13 v51.05,39.62 | RP9.4 118.51,18.63 117.12,18.63 116.84,18.29 v116.84,17.27 | C7.1 55.7,30.23 v54.61,30.23 | C14.1 86.2,30.99 86.45,30.73 87.12,30.73 v87.63,31.24 | C6.1 55,38.61 v54.36,38.61 | C4.1 62.15,51.49 61.96,51.31 v61.98,51.31 | C9.1 52.83,35.44 52.83,36.9 52.57,37.16 52.57,37.15 v52.58,38.35 | C13.1 86.2,33.53 v84.07,33.53 | U7.127 41.82,24.59 v41.91,24.38 | C15.1 77.25,47.12 v77.47,47.24 | C12.1 86.2,36.07 87.38,36.07 v87.88,35.56 | C56.1 68.4,50.45 v68.33,50.29 | C16.1 72.9,47.13 v72.9,46.48 | C10.1 61.07,16.67 v61.18,16.79 | C11.1 82.44,16.52 82.37,16.3 81.65,16.3 v81.55,16.2
  Top 0.406: R29.1 20.55,34.3 20.69,34.08 C33.1
  Route14 0.127: v81.55,16.2 81.05,15.7 78.95,15.7 78.74,15.49 78.74,8.13 78.99,7.87 106.93,7.87 108.97,9.91 112.27,9.91 112.52,10.16 115.43,10.16 116.25,10.98 116.25,16.6 116.83,17.18 116.83,17.12
  Bottom 0.102: C81.1 v67.65,32.8 | C82.1 v74.85,34.4 | C83.1 v74.85,32.8 | C84.1 71.8,31.85 v71.65,32
  other vias: 19.61,34.88 21.34,34.88 21.51,33.5 19.88,33.49
  pour Top (isolate 0.127): 18.54,35 18.54,33.83 19.46,32.92 19.43,30.56 21.97,30.56 21.97,35.15 18.62,35.18
  pour Route14 (isolate 0.152, rank 2): 130.05,66.8 0.51,66.8 0.51,0.51 130.05,0.51
  pour Route14 (isolate 0.127, rank 2): 73.95,42.5 73.95,38.5 78.35,38.5 80.55,36.3 84.05,36.3 84.25,36.5 84.25,36.7 85.85,38.3 85.85,51.9 86.25,52.3 105.05,52.3 106.25,53.5 106.25,65.8 105.65,66.4 26.55,66.4 26.25,66.7 26.25,63.6 27.45,62.4 27.45,53.8 28.05,53.2 79.05,53.2 80.55,51.7 80.55,45.3 78.15,42.9 74.85,42.9
  pour Route14 (isolate 0.203): 39.45,60 39.45,23.4 46.45,16.4 97.25,16.4 100.05,19.2 100.05,59.3 98.05,61.3 40.45,61.3 39.55,60.4
  pour Route14 (isolate 0.102): 61.34,41.05 61.34,25.86 78.82,25.86 78.82,25.88 78.87,25.88 79.1,35.53 79.45,37.03 79.45,37.57 84.23,37.57 84.23,41.73 84.86,41.73 84.86,58.24 84.56,58.24 84.56,59.16 83.13,59.16 83.13,49.23 82.8,49.23 82.8,42.62 82.55,42.62 82.55,42.47 74.22,42.47 74.24,41.07
+1V2_TM4C  (via drill 0.2, 0.2 pad 0.46)
  Top 0.127: 29.03,31.06 U7.87 30.19,31.06 arc-90 v30.25,31 | C49.1 33.89,24.16 arc90 v33.85,24.2 | U7.115 37.02,27.43 arc90 v36.85,27.6 | C47.1 27.18,35.31 v27.18,36.58
  Top 0.203: C50.1 30.4,45.55 arc90 v30.45,45.6
  pour Route14: 25.4,46.35 25.45,30 25.85,29.4 29.05,29.4 29.2,25 29.54,23.66 37.53,23.66 37.53,28.57 33.66,28.57 33.02,29.21 33.02,47.62 26.67,47.62
+3V3  (via drill 0.2 pad 0.25, 0.2 pad 0.46, 0.25 pad 0.46)
  Top 0.102: U1.F12 v67.65,35.2 | U1.F13 v67.65,36 | U1.F14 v67.65,36.8 | U1.F8 v67.65,31.2 | U1.F7 v67.65,30.4 | U1.F6 v67.65,29.6 | U1.G6 v68.45,29.6 | U1.H6 v69.25,29.6 | U1.G14 v68.45,36.8 | U1.H14 v69.25,36.8 | U1.L14 v72.45,36.8 | U1.M14 v73.25,36.8 | U1.N14 v74.05,36.8 | U1.P14 v74.85,36.8 | U1.P13 v74.85,36 | U1.P12 v74.85,35.2 | U1.F11 v67.65,34.4 | U1.J6 v70.05,29.6 | U1.M6 v73.25,29.6 | U1.N6 v74.05,29.6 | U1.P6 v74.85,29.6 | U1.P7 v74.85,30.4 | U1.P8 v74.85,31.2 | U1.P9 v74.85,32
  Top 0.127: JP4.1 72.39,10.8 | 29.03,29.84 U7.90 29.59,29.84 v29.72,29.97 | C35.1 28.72,25.17 v28.96,25.4 | C40.1 25.76,38.61 v25.15,38.61 | R18.2 v3.99,25.66 | J14.60 103.59,50.57 105.66,50.57 v105.92,50.29 | RP12.5 27.07,43.07 27.38,42.98 v28.96,41.4 | U7.28 44.96,38.25 45.21,38.51 v45.21,39.88 | R11.1 108.21,25.65 v108.46,25.4 | U7.39 39.84,40.09 v39.62,39.88 | U7.122 39.84,24.89 39.59,24.64 v38.86,24.64 | J18.5 5.08,57.58 5.33,57.33 v5.33,56.9 | J15.60 103.59,20.57 105.41,20.57 v106.43,19.56 | J12.59 55.33,48.26 55.58,48.01 v56.39,48.01 | J15.3 92.39,15.94 v91.95,15.49 | RP9.9 120.01,14.86 v120.14,14.48 | U7.7 42.62,29.85 42.6,29.85 42.49,29.74 38.88,29.74 v38.86,29.72 v38.86,29.73 v38.86,29.72 | J12.4 44.13,54.17 v43.94,54.36 | C8.1 26.16,50.94 | U7.26 42.65,37.47 42.42,37.69 v42.42,37.85 | RP11.11 104.9,43.69 v105.41,43.69 | RP11.13 104.4,45.21 v104.9,45.21 | C20.1 64.52,15.83 v64.52,16.51 | J15.4 92.39,21.4 v92.2,21.59 | C18.1 52.5,30.15 v52.32,29.97 | C74.1 77.5,16.72 77.72,16.5 v77.72,16.26 | J12.3 44.13,49.6 v43.94,49.78 | U7.101 31.43,27.24 v31.24,27.43 | U7.68 27.38,38.66 v27.18,38.86 | J14.3 92.39,47.78 92.62,48.01 v92.71,48.01 | J14.59 103.59,47.78 103.82,48.01 v103.89,48.01 | U7.113 36.23,28.11 v36.32,28.45 | J13.59 55.33,16.28 55.12,16.49 v55.12,16.51 | C38.1 32.01,23.62 v32.26,23.37 | C17.1 55.7,23.7 v55.63,23.62 | C43.1 30.73,43.44 v30.48,43.69 | J15.59 103.59,16.72 v103.38,16.51 | J13.60 55.33,18.01 55.12,17.8 v55.12,17.78 | J12.60 55.33,51.03 55.12,50.82 v55.12,50.8 | C72.1 91.55,28.42 v91.44,28.19 | J13.4 44.13,19.12 v43.94,19.3 | J13.3 44.13,15.17 v43.94,14.99 | C75.1 91.65,29.67 v91.44,29.46
  Top 0.127: RP10.1 126.25,61.8 v126.49,61.98 | C44.1 38.55,23.62 38.55,22.66 v38.86,22.35 | U7.69 29.62,38.25 v29.72,38.35 | RP10.3 125.07,61.14 v125.22,60.96 | LED1.A 126.43,60.83 v126.24,60.96 | RP9.11 120.51,15.76 v120.65,15.49 | R3.1 123.8,16.46 v123.7,16.26 | C76.1 73.07,50.7 v72.9,50.55 | U7.16 44.73,33.45 v44.96,33.53 | C57.1 92.2,40.34 v92.2,41.15 | U2.6 114.3,18.09 114.35,18.03 v115.06,18.03 | C37.1 25.23,36.28 v25.15,36.07 | J14.4 92.39,49.34 v92.46,49.28 | C22.1 91.53,33.6 v91.44,33.53 | C73.1 52,25.93 v52.07,25.65 | R8.1 v97.79,28.45 | R6.1 125.48,17.22 v125.73,17.27 | U7.8 42.5,30.25 v42.42,30.23 | U7.79 28.41,34.29 28.1,34.29 28.07,34.26 27.47,34.26 v27.18,34.29 | RP11.7 105.9,44.7 105.92,44.72 v105.92,45.21 | C23.1 68.33,47.13 v68.33,46.23 | C41.1 v36.32,23.11 | R40.1 v18.29,50.04 | U7.51 35.04,40.13 35.29,39.88 v35.81,39.88 | U10.1 v107.95,61.47 | C36.1 v39.37,44.7 | C45.1 v37.34,44.7 | C42.1 v41.4,22.35 | U7.52 34.63,40.27 34.6,40.13 34.35,39.88 v33.02,39.88 | R35.2 v41.4,20.32 | U7.47 36.64,42.74 36.83,42.93 v36.83,45.72 | R9.1 v109.55,37.92 | C21.1 79.72,16.36 79.55,16.2 78.97,16.2 v78.92,16.26
  Top 0.203: R18.2 4.57,26.08 3.75,26.9 1.15,26.9 0.85,27.2 0.85,28.6 1.35,29.1 2.5,29.1 2.7,29.3 2.7,30.15 L1.1 | C46.1 34.29,44.7 v36.32,44.7 | 26.16,50.94 26.53,51.31 v27.43,51.31
  Top 0.406: L1.1 2.9,30.41 C25.1 | 8,11.05 8.1,11.05 8.05,11 | JP2.1 8.1,11.05 8,11.05 | 8,11.05 8,11
  Top 0.508: JP2.1 8,11.05 | 72.39,10.8 v70.55,10.8 | JP4.1 72.39,9.6 v72.12,9.57 | 8.05,11 v8.05,9.8 | 8,11 v6.25,11
  Bottom 0.102: C77.1 U1.F8 v67.65,31.2 | C78.1 U1.F12 v67.65,34.4 | C79.1 72.1,36.45 v72.45,36.8 | C80.1 U1.P8 v74.85,31.2
  Bottom 0.127: J19.1 27.22,20.57 27.22,18.8 v26.42,18.8
  pour Route15 (isolate 0.152, rank 6): 130.05,66.8 0.51,66.8 0.51,0.51 130.05,0.51
  pour Route15 (no thermals): 64.9,39.7 77.83,39.7 77.83,26.82 64.72,26.82 64.72,39.67
+5V  (via drill 0.2, 0.2 pad 0.46, 0.25, 0.25 pad 0.46)
  Top 0.127: U6.3 16.33,36.09 v15.96,35.77 | C29.1 20.72,37.85 v21.39,37.84 | JP5.1 72.39,13.3 | 72.39,14.5 v72.35,14.5 | U5.19 13.04,31.05 | R4.1 122.78,16.68 v122.68,16.26 | RP9.16 121.6,18.7 v121.67,18.8
  Top 0.203: R21.1 8.25,32.96 v8.25,32.45
  Top 0.305: 14.85,31.1 14,31.1 13.95,31.05 13.04,31.05 | U5.18 14.6,30.36 | U5.17 14.56,29.7
  Top 0.406: U5.3 5.67,30.36 C27.1 | U5.2 6.48,31.01 5.93,31.56 5.4,31.56 5.42,31.53 5.42,31.03 5.4,31.05 5.39,31.04 5.39,30.15 | 5.39,30.15 C27.1 | U5.4 5.77,29.7 C27.1 | C30.1 14.85,30.12 | 14.85,30.12 v14.85,31.2 | v14.85,31.2 14.85,31.1 | 14.6,30.36 C30.1 | 14.85,30 C30.1 | JP3.1 8.15,13.64 | JP3.1 8.09,13.65 | JP3.1 8.15,13.59 | v19.2,16.9 19.2,18.77 JP6.2 v17.9,18.8 | C27.1 5.4,30.1 v5.4,31.6 | 5.39,30.15 5.4,30.16 v5.4,32.49 | 14.56,29.7 14.85,30 | 14.85,30 14.85,30.12 | v14.85,31.2 14.52,31.42 14.49,31.44 v14.49,32.26 | PTC1.1 v18.15,41.75 | PTC1.1 18.15,40.43 v18.15,39 | PTC1.1 16.04,40.44 v16,40.4 | PTC1.1 19,40.44 | 19,40.44 20.41,40.44 v20.45,40.4 | 21.47,42.7 C55.1 21.55,42.74 | 21.47,42.7 20,42.7 19,41.7 19,40.44 | 21.47,42.7 21.5,42.67 v21.5,41.15
  Top 0.508: 72.39,13.3 v70.45,13.3 | JP5.1 72.39,14.5 | 8.09,13.65 8.09,13.6 v6.25,13.6 | 8.15,13.59 v8.15,14.7
  pour Route14 (isolate 0.127): 0.76,66.55 0.76,1.02 1.02,0.76 79.76,0.81 79.86,0.71 130,0.71 130.05,0.76 130.05,19.56 119.96,19.56 119.96,14.22 120.02,5.71 78.74,5.71 78.11,6.35 78.11,13.97 76.84,15.24 70.48,15.24 69.85,14.61 69.85,6.35 68.58,5.08 11.43,5.08 9.53,6.35 9.53,15.24 10.16,14.61 20.06,14.61 20.06,18.55 18.03,19.48 18.03,36.83 22.35,36.83 22.35,26.15 24.13,26.15 24.16,48.37 21.99,48.34 8.47,48.23 8.43,63.48 3.81,63.5 3.81,66.55
+5V_JACK
  pour Top (isolate 0.254): 1.27,47.88 1.27,38.86 1.52,38.61 15.24,38.61 15.24,44.45 20.32,44.45 20.32,47.5 19.05,48.51 11.68,48.51 9.91,47.88
+5V_USB  (via drill 0.2 pad 0.46)
  Top 0.127: 8.5,22.07 FB1.2 v10.16,22.1 | RP12.11 25.79,44.56 25.29,45.06 RP12.14 23.98,45.06 23.62,44.7 v23.62,44.2 | v32.77,27.43 32.26,27.94 32.26,34.04 32.51,34.29 37.34,34.29 37.59,34.04 37.59,28.19 37.85,27.94 41.66,27.94 42.67,26.92 45.47,26.92 45.97,27.43 R34.2 | v28.41,26.97 U7.96
  Top 0.203: 8.5,22.07 8.5,21.3 8.55,21.25 10.85,21.25 v10.85,20.32 10.85,20.3 10.33,19.93 U3.5
  Top 0.406: FB1.2 8.47,22.92 arc-90 8.5,22.95 8.62,23.07 C51.1 10.02,23.88 11.25,22.65 U9.1
  Route3 0.127: v23.62,18.29 25.65,18.29 25.91,18.54 25.91,19.81 v26.42,20.32 | v28.41,26.97 32.3,26.97 v32.77,27.43 | v23.62,17.27 25.4,17.27 25.65,17.02 25.65,16.26 25.4,16 15.06,16 14.8,16.26 14.8,21.01 14.48,21.34 10.37,21.34 10.11,21.59 10.11,22.05 v10.16,22.1
  Bottom 0.127: v28.41,26.97 26.42,24.98 v26.42,20.32 | v23.62,44.2 24.38,43.43 24.38,19.05 v23.62,18.29 v23.62,17.27
AD1EVT/MII_RX_ER/RMII_RX_ER/NTZ1_1  (via drill 0.2 pad 0.46)
  Top 0.102: U1.N19 73.65,41.2 73.65,41.4 73.66,41.41 73.66,41.95
  Top 0.127: v91.69,48.01 92.2,48.51 93.74,48.51 93.99,48.77 J14.12 | v86.11,52.32 85.6,52.83 81.28,52.83 81.03,52.58 81.03,49.53 80.77,49.28 74.68,49.28 74.42,49.02 74.42,46.23 74.17,45.97 73.91,45.97 73.66,45.72 73.66,41.95
  Route3 0.127: J8.9 101.6,50.29 101.35,50.04 91.95,50.04 91.69,49.78 v91.69,48.01
  Bottom 0.127: J8.9 101.6,54.99 101.35,55.24 92.84,55.24 92.46,54.86 92.46,53.09 92.2,52.83 86.61,52.83 v86.11,52.32
AD1IN_0  (via drill 0.2 pad 0.46)
  Top 0.102: U1.W14 79.25,36.4 79.76,36.4 79.93,36.58 80.13,36.58
  Top 0.127: v90.17,36.58 80.13,36.58 | v82.8,9.14 82.8,11.68 83.06,11.94 84.84,11.94 85.09,12.19 85.09,28.45 85.34,28.7 87.63,28.7 v88.14,29.21
  Route3 0.127: v88.14,29.21 88.39,28.96 94.49,28.96 94.74,29.21 94.74,31.75 94.49,32 90.42,32 90.17,32.26 v90.17,36.58 | v82.8,9.14 81.28,7.62 71.12,7.62 69.85,8.89 68.58,8.89 67.82,8.13 65.79,8.13 65.02,8.89 24.13,8.89 23.88,9.14 23.88,12.32 J3.3
AD1IN_1  (via drill 0.2 pad 0.46)
  Top 0.102: U1.V17 78.05,39.2 79.25,39.2 79.76,39.2 79.84,39.12 80.13,39.12
  Top 0.127: v83.31,39.12 80.13,39.12
  Route3 0.127: v90.68,40.39 90.68,38.1 90.93,37.85 100.08,37.85 101.6,39.37 103.63,39.37 103.89,39.12 114.3,39.12 114.55,38.86 114.55,28.19 114.81,27.94 120.9,27.94 121.16,27.69 121.16,10.92 120.9,10.67 110.24,10.67 109.98,10.41 109.98,8.64 109.73,8.38 94.23,8.38 93.98,8.64 J5.6
  Bottom 0.127: v90.68,40.39 90.42,40.13 84.33,40.13 v83.31,39.12
AD1IN_2  (via drill 0.2 pad 0.46)
  Top 0.102: U1.V18 78.05,40 78.05,41.2 78.26,41.41 79.24,41.41 80.01,40.64 80.13,40.64
  Top 0.127: v85.85,41.66 84.84,41.66 83.82,40.64 80.13,40.64
  Route14 0.127: v111.76,13.72 111.76,12.19 111.51,11.94 102.87,11.94 102.72,11.94 102.62,11.84 93.02,11.84 92.68,11.5 92.68,10.11 92.13,9.56 90.88,9.56 90.79,9.65 90.17,9.65 89.92,9.91 89.92,12.32 J7.4
  Bottom 0.127: v111.76,13.72 109.47,16 109.47,34.04 108.97,34.54 108.97,41.91 108.71,42.16 86.36,42.16 v85.85,41.66
AD1IN_3  (via drill 0.2 pad 0.25, 0.2 pad 0.46)
  Top 0.102: U1.T17 v76.45,39.2
  Top 0.127: v108.71,12.7 108.2,12.19 102.87,12.19 102.62,11.94 102.62,9.65 102.36,9.4 93.22,9.4 92.96,9.65 92.96,11.81 J7.5
  Bottom 0.102: v76.45,39.2 76.45,41.2 77.78,41.2 78.23,41.66 78.23,41.95
  Bottom 0.127: v108.71,12.7 109.22,12.19 112.27,12.19 112.52,12.45 112.52,20.83 113.03,21.34 113.03,23.11 112.78,23.37 112.52,23.37 112.27,23.62 112.27,24.38 113.03,25.15 113.03,29.97 111.76,31.24 111.76,48.26 111.51,48.51 90.68,48.51 89.92,47.75 78.49,47.75 78.23,47.5 78.23,41.95
AD1IN_4  (via drill 0.2 pad 0.46)
  Top 0.102: U1.U18 77.25,40 77.25,41.2 77.25,41.91 80.13,41.91
  Top 0.127: v83.82,41.4 83.31,41.91 80.13,41.91
  Route3 0.127: v96.27,27.43 95,26.16 84.07,26.16 83.82,26.42 83.82,32.77 83.06,33.53 83.06,36.58 83.82,37.34 v83.82,41.4
  Route14 0.127: v96.27,27.43 98.21,27.43 98.66,27.89 98.66,29.77 99.11,30.43 100.05,30.43 100.25,30.03 100.25,27 101.05,26.2 101.05,26 101.57,25.15 101.57,24.18 101.05,23.4 101.05,20.53 100.33,19.81 99.26,19.81 99.11,19.56 99.11,18.9 98.55,18.54 97.54,18.54 97.38,18.6 94.45,18.6 94.26,18.51 93.82,18.51 93.65,18.34 93.65,16.13 93.48,16.13 93.48,15.51 93.49,15.51 93.49,14.94 93.27,14.94 92.69,14.45 92.7,12.53 93.22,12.07 95.38,12.07 J7.7
AD1IN_5  (via drill 0.2 pad 0.25, 0.2 pad 0.46)
  Top 0.102: U1.R17 v75.65,39.2
  Top 0.127: v108.46,57.15 107.7,57.91 107.7,58.67 108.71,59.69 108.71,61.72 109.47,62.48 109.47,63.5 109.73,63.75 117.6,63.75 117.6,63.5 117.86,63.25 v119.38,63.25
  Route3 0.127: v119.38,63.25 J9.47
  Bottom 0.102: v75.65,39.2 75.65,41.2 75.65,41.95
  Bottom 0.127: v108.46,57.15 106.93,58.67 106.93,59.69 106.68,59.94 75.95,59.94 75.69,59.69 75.69,52.83 75.44,52.58 73.66,52.58 73.41,52.32 73.41,48.26 73.66,48.01 75.69,48.01 75.95,47.75 75.95,44.01 75.65,44.01 75.65,41.95
AD1IN_6  (via drill 0.2 pad 0.46)
  Top 0.102: U1.T19 76.05,41.2 76.05,41.66 76.2,41.81 76.2,41.95
  Top 0.127: v109.98,62.48 109.92,62.42 109.6,62.02 U10.3 109.6,60.45 109.53,60.38 C24.1 | v94.49,45.21 93.22,43.94 83.31,43.94 82.04,42.67 76.2,42.67 76.2,41.95
  Route3 0.127: v109.98,62.48 109.47,61.98 v109.37,46.99
  Bottom 0.127: v109.98,62.48 111.76,64.26 120.78,64.26 J9.48 | v109.37,46.99 95.25,46.99 95,46.74 95,45.72 v94.49,45.21
AD1IN_7  (via drill 0.2 pad 0.46)
  Top 0.102: U1.V14 78.05,36.8 79.25,36.8 79.5,36.8 79.53,36.83 80.13,36.83
  Top 0.127: v34.54,15.49 29.21,15.49 28.96,15.24 28.96,9.65 28.7,9.4 24.64,9.4 24.38,9.65 24.38,12.32 J3.4 | v88.14,40.64 88.14,37.08 87.88,36.83 80.13,36.83
  Route3 0.127: v77.72,14.73 77.47,14.99 69.85,14.99 69.09,14.22 52.83,14.22 52.58,13.97 41.91,13.97 41.4,14.48 35.56,14.48 35.31,14.73 35.31,19.05 35.05,19.3 33.78,19.3 33.53,19.05 33.53,16.51 v34.54,15.49 | v88.14,40.64 89.41,39.37 89.41,37.34 89.66,37.08 90.42,37.08 90.68,36.83 v90.68,35.56
  Bottom 0.127: v90.68,35.56 91.19,36.07 99.31,36.07 100.33,35.05 103.38,35.05 103.63,34.8 103.63,19.05 103.38,18.8 87.12,18.8 86.11,19.81 80.77,19.81 80.52,19.56 80.52,18.54 80.26,18.29 78.74,18.29 78.49,18.03 78.49,15.49 v77.72,14.73
AD1IN_8/AD2IN_8
  Top 0.102: U1.P18 74.85,40 74.85,41.2 74.85,41.95
  Top 0.127: 74.85,41.95 74.85,44.45 86.87,44.45 87.12,44.7 87.12,46.99 88.14,48.01 88.14,52.76 88.39,53 105.08,53 105.41,53.34 105.41,63.75 105.66,64.01 107.44,64.01 107.7,64.26 107.7,65.15 107.95,65.41 J9.43
AD1IN_9/AD2IN_9  (via drill 0.2 pad 0.46)
  Top 0.102: U1.W17 79.25,38.8 80.13,38.8
  Top 0.127: v87.38,27.69 85.6,27.69 85.34,27.43 85.34,11.05 85.09,10.79 J5.2 | v85.09,38.86 84.84,38.61 81.12,38.61 81.12,38.8 80.13,38.8
  Route3 0.127: v85.09,38.86 85.09,32.77 85.6,32.26 85.6,31.24 86.11,30.73 86.11,29.46 85.85,29.21 85.85,27.94 86.11,27.69 v87.38,27.69
AD1IN_10/AD2IN_10  (via drill 0.2 pad 0.25, 0.2 pad 0.46)
  Top 0.102: U1.U17 v77.25,39.2
  Top 0.127: v86.36,24.64 J7.3
  Route3 0.127: v81.03,47.24 81.03,44.7 81.79,43.94 81.79,39.18 81.53,38.92 81.03,38.92 81.03,25.15 85.85,25.15 v86.36,24.64
  Bottom 0.102: v77.25,39.2 79.25,39.2 79.25,40.89 78.49,41.66 78.49,41.95
  Bottom 0.127: v81.03,47.24 78.74,47.24 78.49,46.99 78.49,41.95
AD1IN_11/AD2IN_11  (via drill 0.2 pad 0.46)
  Top 0.102: U1.U19 76.85,41.2 76.85,41.4 76.96,41.51 76.96,41.95
  Top 0.127: v98.55,42.93 97.79,42.16 76.96,42.16 76.96,41.95
  Route14 0.127: v98.55,42.93 99.57,41.81 103.18,41.81 103.43,41.66 103.65,41.24 103.65,40.7 103.05,40 103.05,31.6 103.65,31 103.65,29.2 103.45,29 103.45,22.2 103.63,22.02 103.63,19.56 101.05,16.98 101.05,15.84 100.1,14.89 99.1,14.89 98.46,15.63 98.25,15.63 98.24,15.62 95.48,15.62 95.12,15.36 95.12,14.48 J7.6
AD1IN_12/AD2IN_12  (via drill 0.2 pad 0.25, 0.2 pad 0.46)
  Top 0.102: U1.T16 v76.45,38.4
  Route14 0.127: v112.52,25.4 112.01,24.89 112.01,22.61 111.25,21.84 111.25,12.45 111,12.19 100.2,12.19 J7.8
  Bottom 0.102: v76.45,38.4 76.85,38.8 79.25,38.8 79.5,39.05 79.5,41.95
  Bottom 0.127: v112.52,25.4 112.52,28.7 111.51,29.72 111.51,48.01 111.25,48.26 105.92,48.26 105.16,47.5 89.15,47.5 88.14,46.48 78.99,46.48 78.74,46.23 78.74,42.16 79.5,42.16 79.5,41.95
AD1IN_13/AD2IN_13  (via drill 0.2 pad 0.46)
  Top 0.102: U1.T18 76.45,40 76.45,41.2 76.45,41.91 76.71,41.91 76.71,41.95
  Top 0.127: v93.73,43.18 92.96,42.42 76.71,42.42 76.71,41.95
  Route3 0.127: v108.2,50.55 108.46,50.8 108.46,55.12 107.95,55.63 107.95,58.93 108.46,59.44 108.46,62.99 110.24,64.77 110.24,66.29 110.49,66.55 115.7,66.55 J9.46
  Route14 0.127: v108.2,50.55 106.68,52.07 104.14,52.07 103.89,51.82 103.89,50.8 104.14,50.55 104.9,50.55 105.16,50.29 105.16,47.75 104.6,47.19 103.66,47.19 102.95,46.48 102.95,44.15 102.9,44.2 101.35,44.2 101.09,43.94 94.49,43.94 v93.73,43.18
AD1IN_14/AD2IN_14  (via drill 0.2 pad 0.46)
  Top 0.102: U1.R18 75.65,40 75.65,41.2 75.65,41.4 75.69,41.44 75.69,41.95
  Top 0.127: v77.72,43.69 75.69,43.69 75.69,41.95
  Route3 0.127: v80.52,50.8 78.74,49.02 78.74,43.69 v77.72,43.69 | v110.49,60.96 110.49,64.14 J9.44
  Route14 0.127: v81.53,60.96 80.26,59.69 80.26,51.05 v80.52,50.8
  Bottom 0.127: v110.49,60.96 102.87,60.96 102.62,61.21 102.62,62.74 102.36,62.99 85.6,62.99 83.57,60.96 v81.53,60.96
AD1IN_15/AD2IN_15
  Top 0.102: U1.P19 74.45,41.2 74.45,41.95
  Top 0.127: 74.45,41.95 74.45,44.7 82.55,44.7 82.8,44.96 82.8,50.38 83.06,50.63 87.47,50.63 87.88,51.05 87.88,54.86 88.14,55.12 104.9,55.12 105.16,55.37 105.16,64.39 J9.41
AD1IN_16/AD2IN_0  (via drill 0.2 pad 0.46)
  Top 0.102: U1.V13 78.05,36 79.25,36 79.5,36 79.57,36.07 80.13,36.07
  Top 0.127: v99.57,42.93 98.55,41.91 93.98,41.91 93.73,41.66 93.73,36.32 93.47,36.07 89.92,36.07 89.66,36.32 85.6,36.32 85.34,36.07 80.13,36.07 | v66.55,7.37 v109.47,7.37
  Route14 0.127: v66.55,7.37 66.04,6.8 20.57,6.8 20.32,7.11 J1.2 | v99.57,42.93 99.85,42.64 99.85,42.2 99.92,42.13 103.49,42.13 103.95,41.56 103.95,40.6 103.35,39.9 103.35,31.8 103.89,31.36 103.89,26.16 104.9,25.15 104.9,21.95 104.25,21.3 104.25,15.64 104.65,15.24 108.2,15.24 v108.46,14.99
  Bottom 0.127: v109.47,7.37 108.2,8.64 108.2,14.73 v108.46,14.99
AD1IN_17/AD2IN_1  (via drill 0.2 pad 0.25, 0.2 pad 0.46)
  Top 0.102: U1.U13 v77.25,36
  Top 0.127: v24.89,6.1 27.33,8.54 30.13,8.54 30.48,8.89 J1.6 | v25.4,20.57 24.89,20.07 v23.62,20.07
  Route3 0.127: v86.11,42.93 86.11,50.8 86.36,51.05 88.39,51.05 88.65,51.31 88.65,52.32 89.92,53.59 89.92,58.42 89.66,58.67 58.67,58.67 58.42,58.93 58.42,64.19 58.17,64.44 57.73,64.44 57.4,64.77 57.4,66.29 57.15,66.55 44.45,66.55 44.2,66.29 44.2,63.75 43.94,63.5 26.67,63.5 26.42,63.25 26.42,41.4 25.65,40.64 25.65,20.83 v25.4,20.57
  Bottom 0.102: v77.25,36 79.25,36 79.5,36 79.57,36.07 80.13,36.07
  Bottom 0.127: v23.62,20.07 22.86,19.3 22.86,16.76 24.13,15.49 24.13,6.86 v24.89,6.1 | v86.11,42.93 88.39,42.93 88.65,43.18 88.65,43.69 88.39,43.94 82.55,43.94 82.3,43.69 82.3,36.32 82.04,36.07 80.13,36.07
AD1IN_18/AD2IN_2  (via drill 0.2 pad 0.25, 0.2 pad 0.46)
  Top 0.102: U1.U14 v77.25,36.8
  Top 0.127: v17.53,4.83 17.53,3.81 17.27,3.56 4.83,3.56 4.57,3.81 4.57,11.94 v5.08,12.45 | v105.92,46.48 106.43,46.99 106.43,53.85 v108.46,55.88
  Route3 0.127: v5.08,12.45 5.33,12.19 16.26,12.19 16.51,12.45 16.51,14.48 16.76,14.73 26.54,14.73 J3.5 | v86.36,9.14 86.36,6.35 86.11,6.1 57.4,6.1 56.9,5.59 43.18,5.59 42.67,5.08 32.26,5.08 30.73,6.6 25.65,6.6 25.4,6.35 25.4,5.08 25.15,4.83 v17.53,4.83 | v123.95,28.7 124.21,28.45 124.21,3.81 123.95,3.56 93.98,3.56 93.29,2.87 92.46,2.87 v92.46,9.14
  Bottom 0.102: v77.25,36.8 79.25,36.8 79.5,36.8 79.53,36.83 80.13,36.83
  Bottom 0.127: v92.46,9.14 91.95,8.64 86.87,8.64 v86.36,9.14 | v108.46,55.88 120.9,55.88 121.16,55.63 121.16,50.51 120.9,50.26 118.36,50.26 116.88,48.77 112.52,48.77 112.27,48.51 112.27,37.08 112.52,36.83 113.79,36.83 115.06,35.56 123.59,35.53 125.06,33.73 125.06,30.32 v123.95,28.7 | v123.95,28.7 | v105.92,46.48 105.66,46.74 100.58,46.74 99.31,45.47 98.3,45.47 97.79,45.97 97.03,45.97 95.5,44.45 82.04,44.45 81.79,44.2 81.79,37.08 81.53,36.83 80.13,36.83
AD1IN_19/AD2IN_3  (via drill 0.2 pad 0.25, 0.2 pad 0.46)
  Top 0.102: U1.U16 v77.25,38.4
  Top 0.127: v95.5,62.48 95.25,62.74 28.19,62.74 27.94,62.48 27.94,59.44 28.19,59.18 v31.5,59.18
  Route3 0.127: v31.5,59.18 31.5,52.58 32.77,51.31 v32.77,45.72 | v111,47.5 110.49,48.01 v110.49,59.94
  Bottom 0.102: v77.25,38.4 79.25,38.4 79.76,38.91 79.76,41.95
  Bottom 0.127: v32.77,45.72 32.26,45.21 32.26,27.18 33.02,26.42 33.02,14.73 32.77,14.48 31.62,14.48 J3.6 | v110.49,59.94 109.98,60.45 101.09,60.45 100.84,60.71 100.84,62.23 100.58,62.48 v95.5,62.48 | v111,47.5 108.97,47.5 108.71,47.24 89.41,47.24 88.39,46.23 79.25,46.23 78.99,45.97 78.99,42.88 79.76,42.88 79.76,41.95
AD1IN_20/AD2IN_4  (via drill 0.2 pad 0.25, 0.2 pad 0.46)
  Top 0.102: U1.U15 v77.25,37.6
  Top 0.127: v38.1,16.26 37.34,15.49 37.08,15.49 36.58,14.99 34.29,14.99 34.04,15.24 33.27,15.24 33.02,14.99 J3.7 | v80.52,43.18 v76.2,43.18
  Route3 0.127: v76.2,43.18 76.2,42.67 61.21,42.67 60.96,42.93 54.36,42.93 53.85,43.43 50.55,43.43 50.04,42.93 48.26,42.93 48.01,42.67 48.01,41.66 48.26,41.4 48.77,41.4 49.02,41.15 v49.02,38.86
  Bottom 0.102: v77.25,37.6 79.25,37.6 80.13,37.6
  Bottom 0.127: v49.02,38.86 38.35,38.86 38.1,38.61 v38.1,16.26 | v80.52,43.18 80.52,37.6 80.13,37.6
AD1IN_21/AD2IN_5  (via drill 0.2 pad 0.25, 0.2 pad 0.46)
  Top 0.102: U1.T15 v76.45,37.6
  Route3 0.127: v42.42,54.61 43.43,55.63 55.63,55.63 56.39,54.86 63.5,54.86 65.02,56.39 72.39,56.39 72.9,55.88 77.09,55.88 78.23,55.3 78.23,44.86 77.98,44.6 77.22,44.6 77.22,43.18 79.5,43.18 v79.5,43.69 | v22.61,39.62 22.61,46.23 v23.11,46.74
  Bottom 0.102: v76.45,37.6 76.85,38 79.25,38 80.01,38.76 80.01,41.95
  Bottom 0.127: v79.5,43.69 80.01,43.69 80.01,41.95 | v23.11,46.74 30.48,46.74 30.73,46.99 30.73,52.32 30.99,52.58 33.78,52.58 34.04,52.83 34.04,54.86 34.29,55.12 41.91,55.12 v42.42,54.61 | v22.61,39.62 19.56,39.62 19.3,39.37 19.3,36.32 19.56,36.07 22.1,36.07 22.35,35.81 22.35,22.61 22.1,22.35 18.8,22.35 18.54,22.1 18.54,15.24 19.05,14.73 19.05,5.59 17.02,3.56 17.02,3.3 16.76,3.05 16.76,1.02 17.02,0.76 21.08,0.76 21.34,1.02 21.34,4.25 21.59,4.5 26.34,4.5 26.67,4.83 26.67,11.68 26.92,11.94 34.16,11.94 J3.8
AD1IN_22/AD2IN_6  (via drill 0.2 pad 0.46)
  Top 0.102: U1.R19 75.25,41.2 75.25,41.66 75.44,41.84 75.44,41.95
  Top 0.127: v87.88,46.99 87.88,44.45 87.63,44.2 75.44,44.2 75.44,41.95
  Route14 0.127: v87.88,46.99 87.88,61.72 88.14,62.18 88.36,62.2 88.76,62.6 94.55,62.6 94.95,62 95.84,61.98 96.46,62.9 101.85,62.9 102.15,62.5 107.7,62.48 108.46,63.25 116.84,63.25 117.09,62.99 117.09,59.18 117.35,58.93 125.48,58.93 125.73,59.18 125.73,66.29 125.48,66.55 123.7,66.55 123.44,66.29 123.44,60.45 123.19,60.2 121.16,60.2 120.9,60.45 120.9,64.01 120.65,64.26 115.44,64.26 J9.45
AD1IN_23/AD2IN_7  (via drill 0.2 pad 0.25, 0.2 pad 0.46)
  Top 0.102: U1.R16 v75.65,38.4
  Route3 0.127: v76.96,46.23 76.96,52.32 76.71,52.58 74.42,52.58 v73.91,53.09
  Bottom 0.102: v75.65,38.4 76.05,38.8 76.05,41.2 76.05,41.95
  Bottom 0.127: v73.91,53.09 73.91,63.25 72.64,64.52 72.64,66.29 72.9,66.55 105.54,66.55 J9.42 | v76.96,46.23 76.96,42.16 76.05,42.16 76.05,41.95
AD1IN_24  (via drill 0.2 pad 0.46)
  Top 0.102: U1.N18 74.05,40 74.05,41.2 74.05,41.66 74.17,41.77 74.17,41.95
  Top 0.127: v87.38,51.82 82.8,51.82 82.55,51.56 82.55,45.97 82.3,45.72 74.42,45.72 74.17,45.47 74.17,41.95
  Route14 0.127: v87.38,51.82 87.63,52.07 87.63,61.94 88.48,63.19 100.33,63.19 100.84,63.5 117.35,63.5 117.6,63.25 117.6,59.69 117.86,59.44 124.21,59.44 124.46,59.69 J9.49
AD1IN_25  (via drill 0.2 pad 0.25, 0.2 pad 0.46)
  Top 0.102: U1.P17 v74.85,39.2
  Route3 0.127: v74.93,51.05 v74.93,47.5 | v127,58.93 v127,56.39
  Bottom 0.102: v74.85,39.2 74.85,41.2 74.85,41.66 74.93,41.74 74.93,41.95
  Bottom 0.127: v74.93,47.5 74.93,41.95 | v127,56.39 106.93,56.39 106.68,56.64 106.68,59.44 106.43,59.69 78.74,59.69 78.49,59.44 78.49,54.61 v74.93,51.05 | v127,58.93 J9.50
AD1IN_26  (via drill 0.2 pad 0.25, 0.2 pad 0.46)
  Top 0.102: U1.P16 v74.85,38.4
  Route3 0.127: v75.44,45.21 77.72,45.21 77.98,45.47 77.98,54.86 77.01,55.37 v75.18,55.37
  Bottom 0.102: v74.85,38.4 75.25,38.8 75.25,41.2 75.25,41.95
  Bottom 0.127: v75.18,55.37 75.18,61.85 J9.31 | v75.44,45.21 75.25,45.02 75.25,41.95
AD1IN_27  (via drill 0.2 pad 0.25, 0.2 pad 0.46)
  Top 0.102: U1.P15 v74.85,37.6
  Route14 0.102: v74.85,37.6 74.45,38 73.66,38 73.66,41.95
  Route14 0.127: v80.52,61.21 81.03,61.72 82.04,61.72 82.3,61.47 82.3,52.58 82.04,52.32 82.04,42.42 81.79,42.16 73.66,42.16 73.66,41.95
  Bottom 0.127: v80.52,61.21 79.76,60.45 77.98,60.45 77.72,60.71 77.72,61.85 J9.32
AD1IN_28  (via drill 0.2 pad 0.25)
  Top 0.102: U1.R15 v75.65,37.6
  Route14 0.102: v75.65,37.6 76.05,38 77.98,38 78.08,38.1 80.13,38.1